# Altium schematic sheet Avalon2.SchDoc
size A1
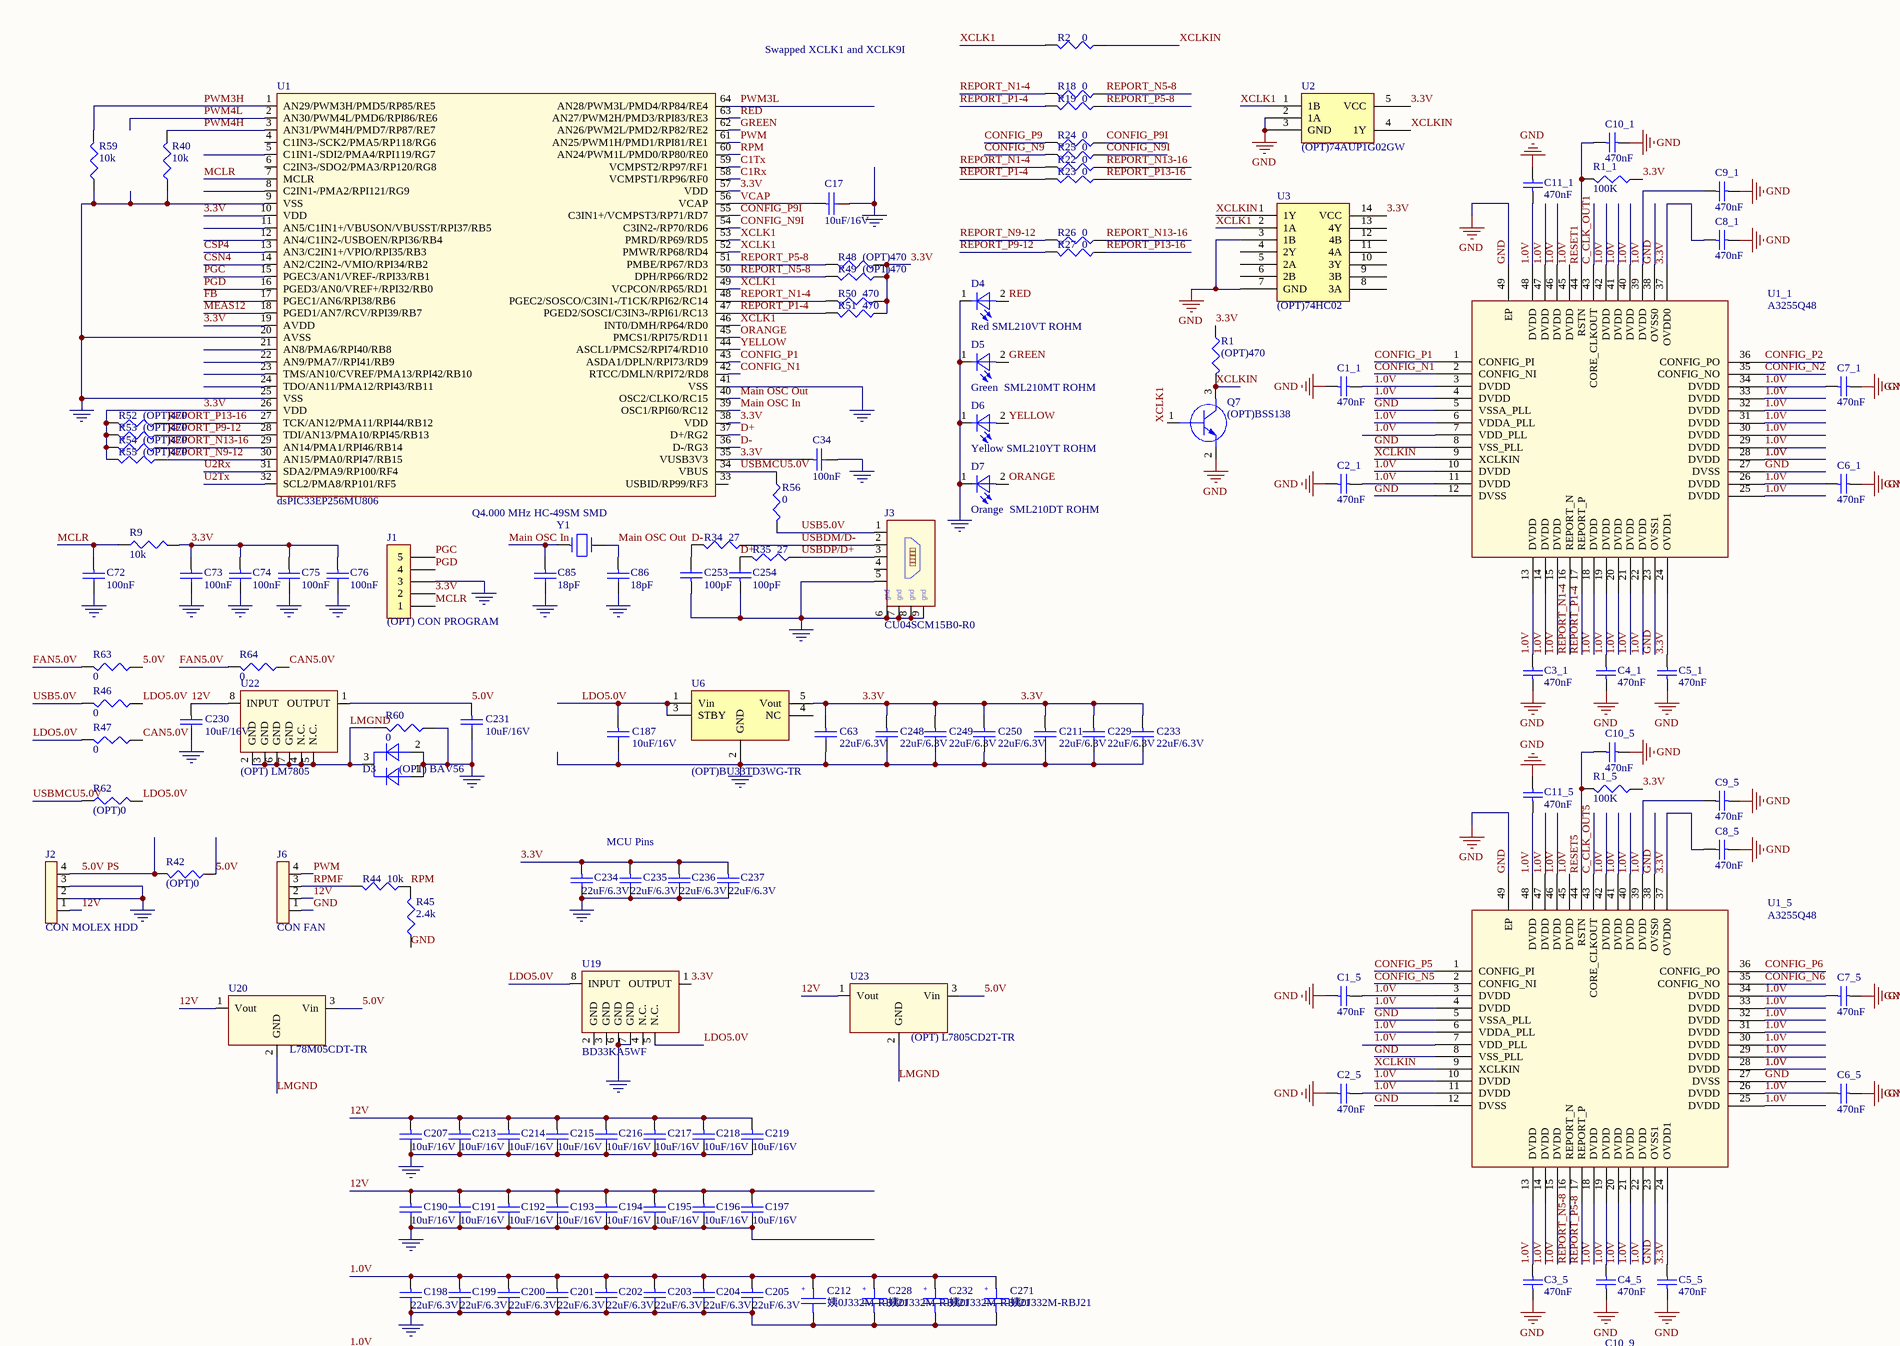
[diagram p0: Avalon2.SchDoc, top left]
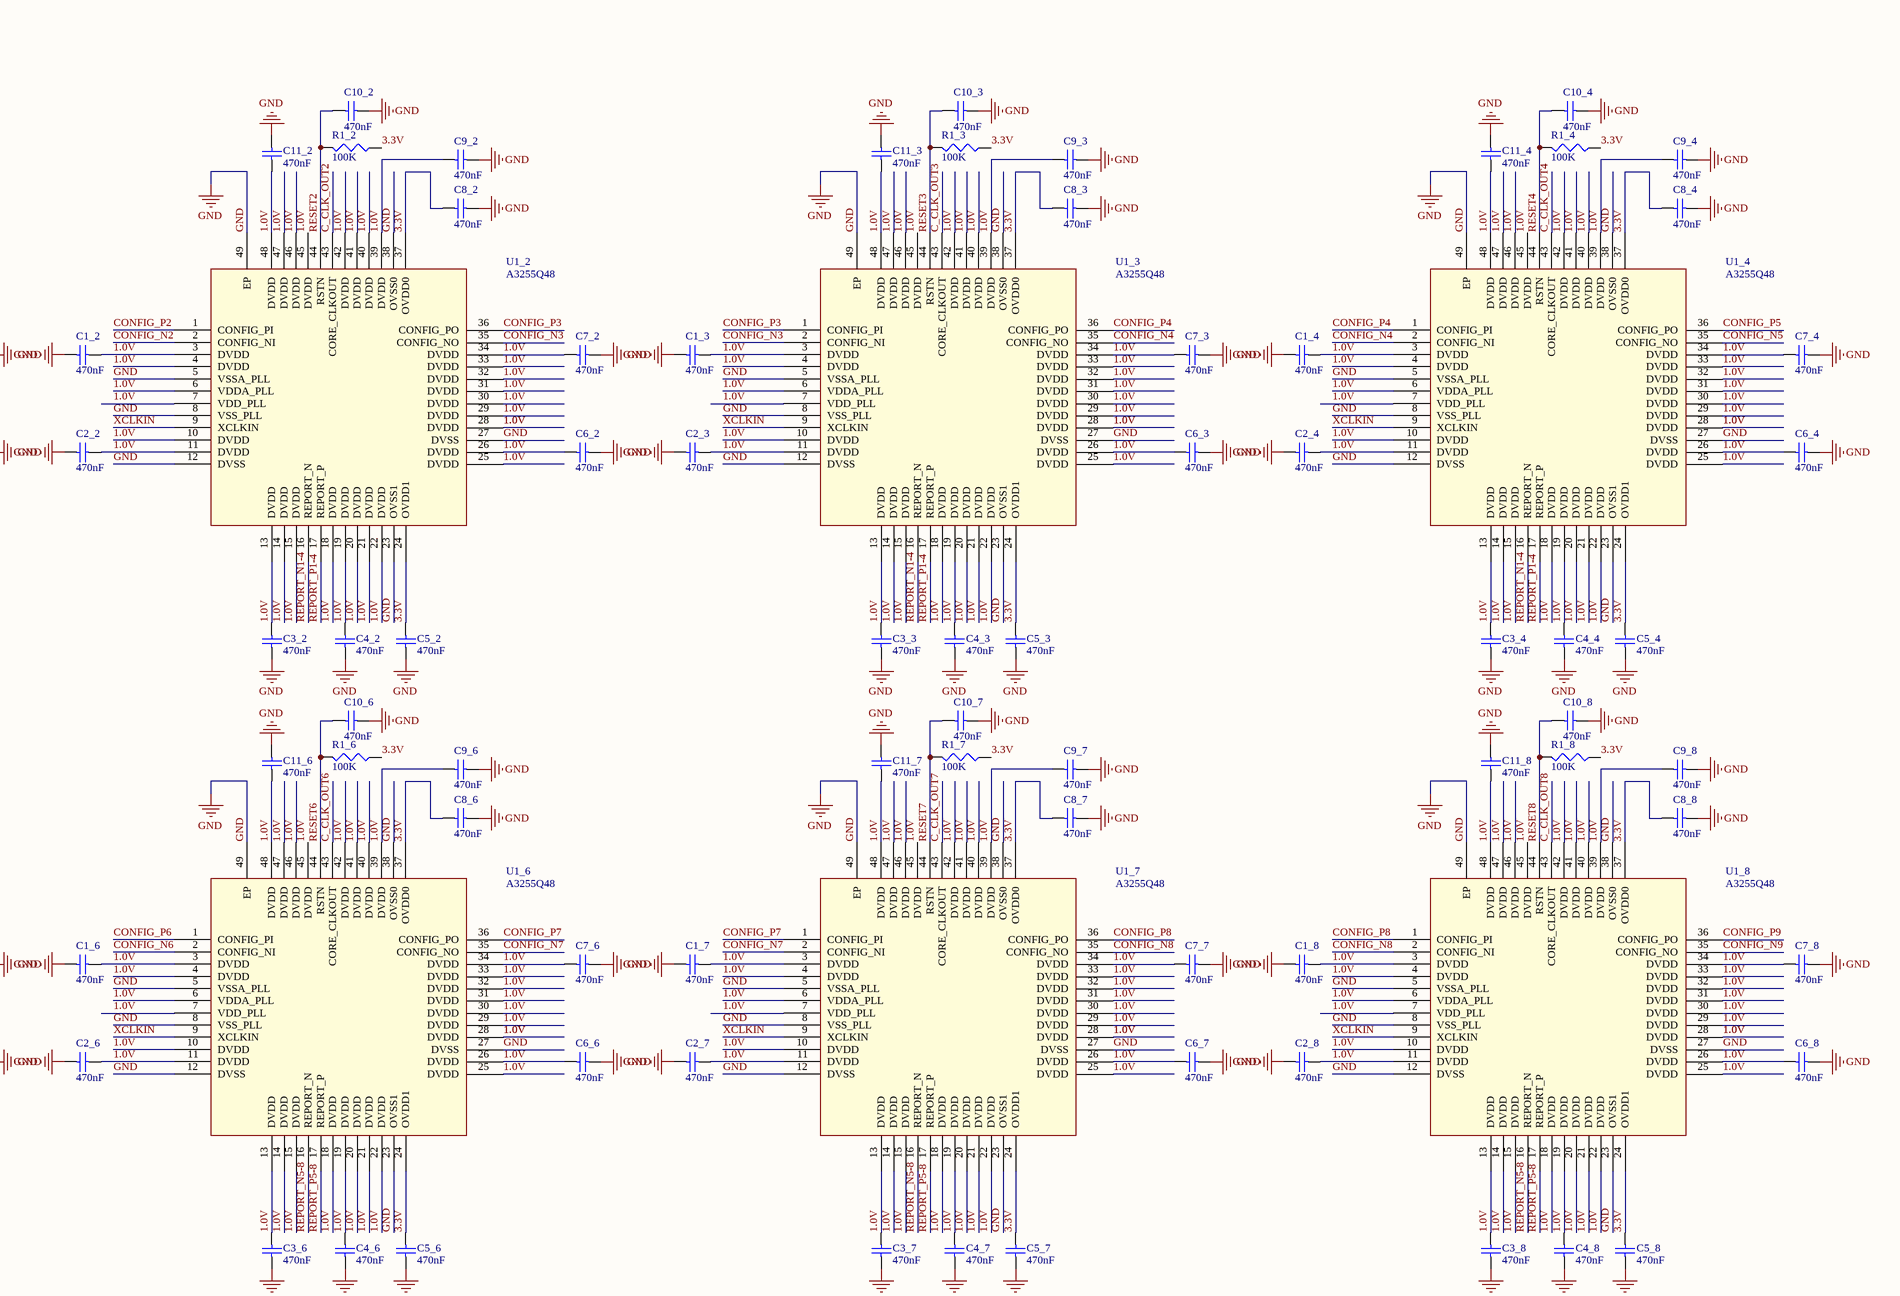
[diagram p1: Avalon2.SchDoc, top right]
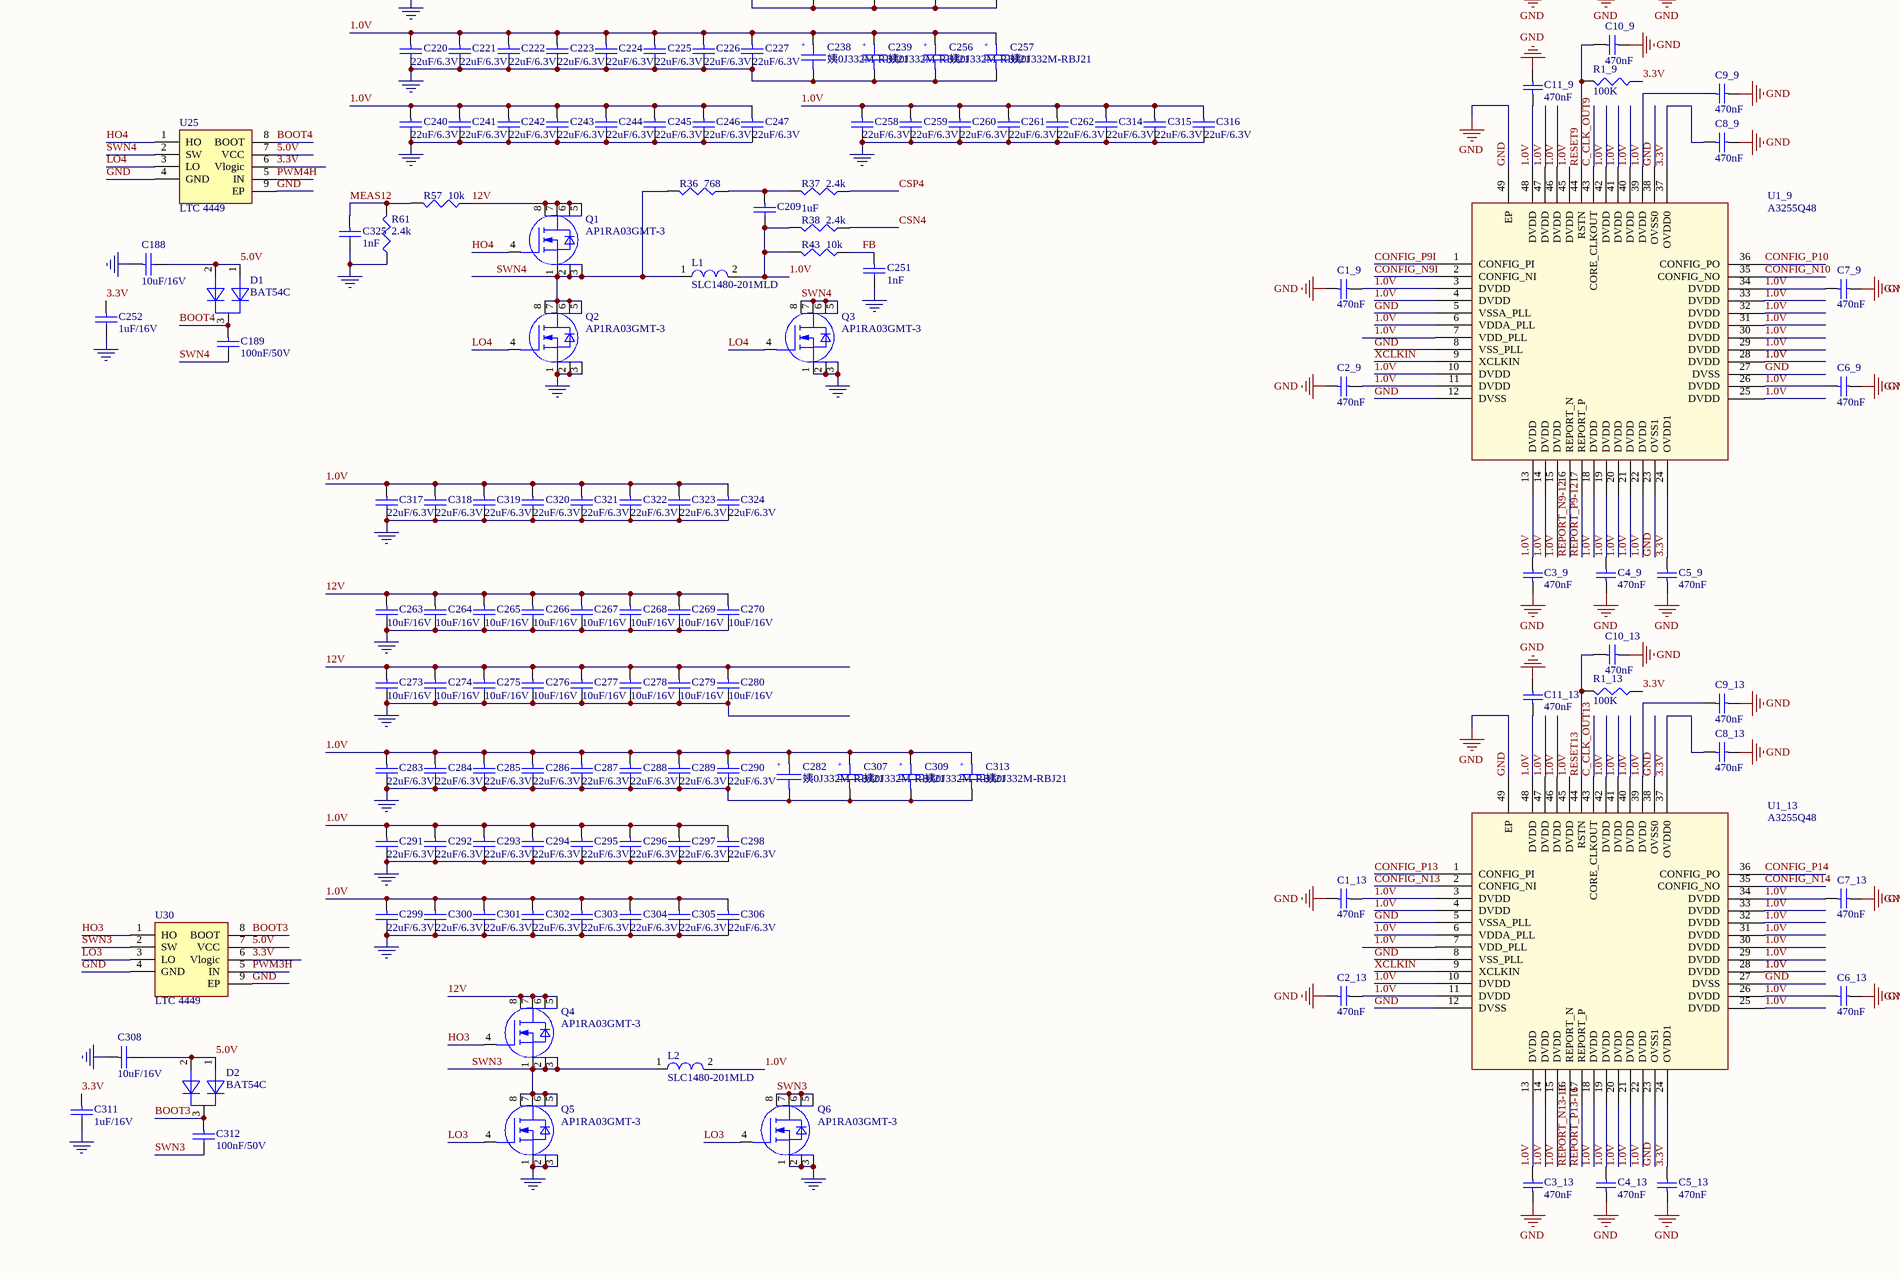
[diagram p2: Avalon2.SchDoc, bottom left]
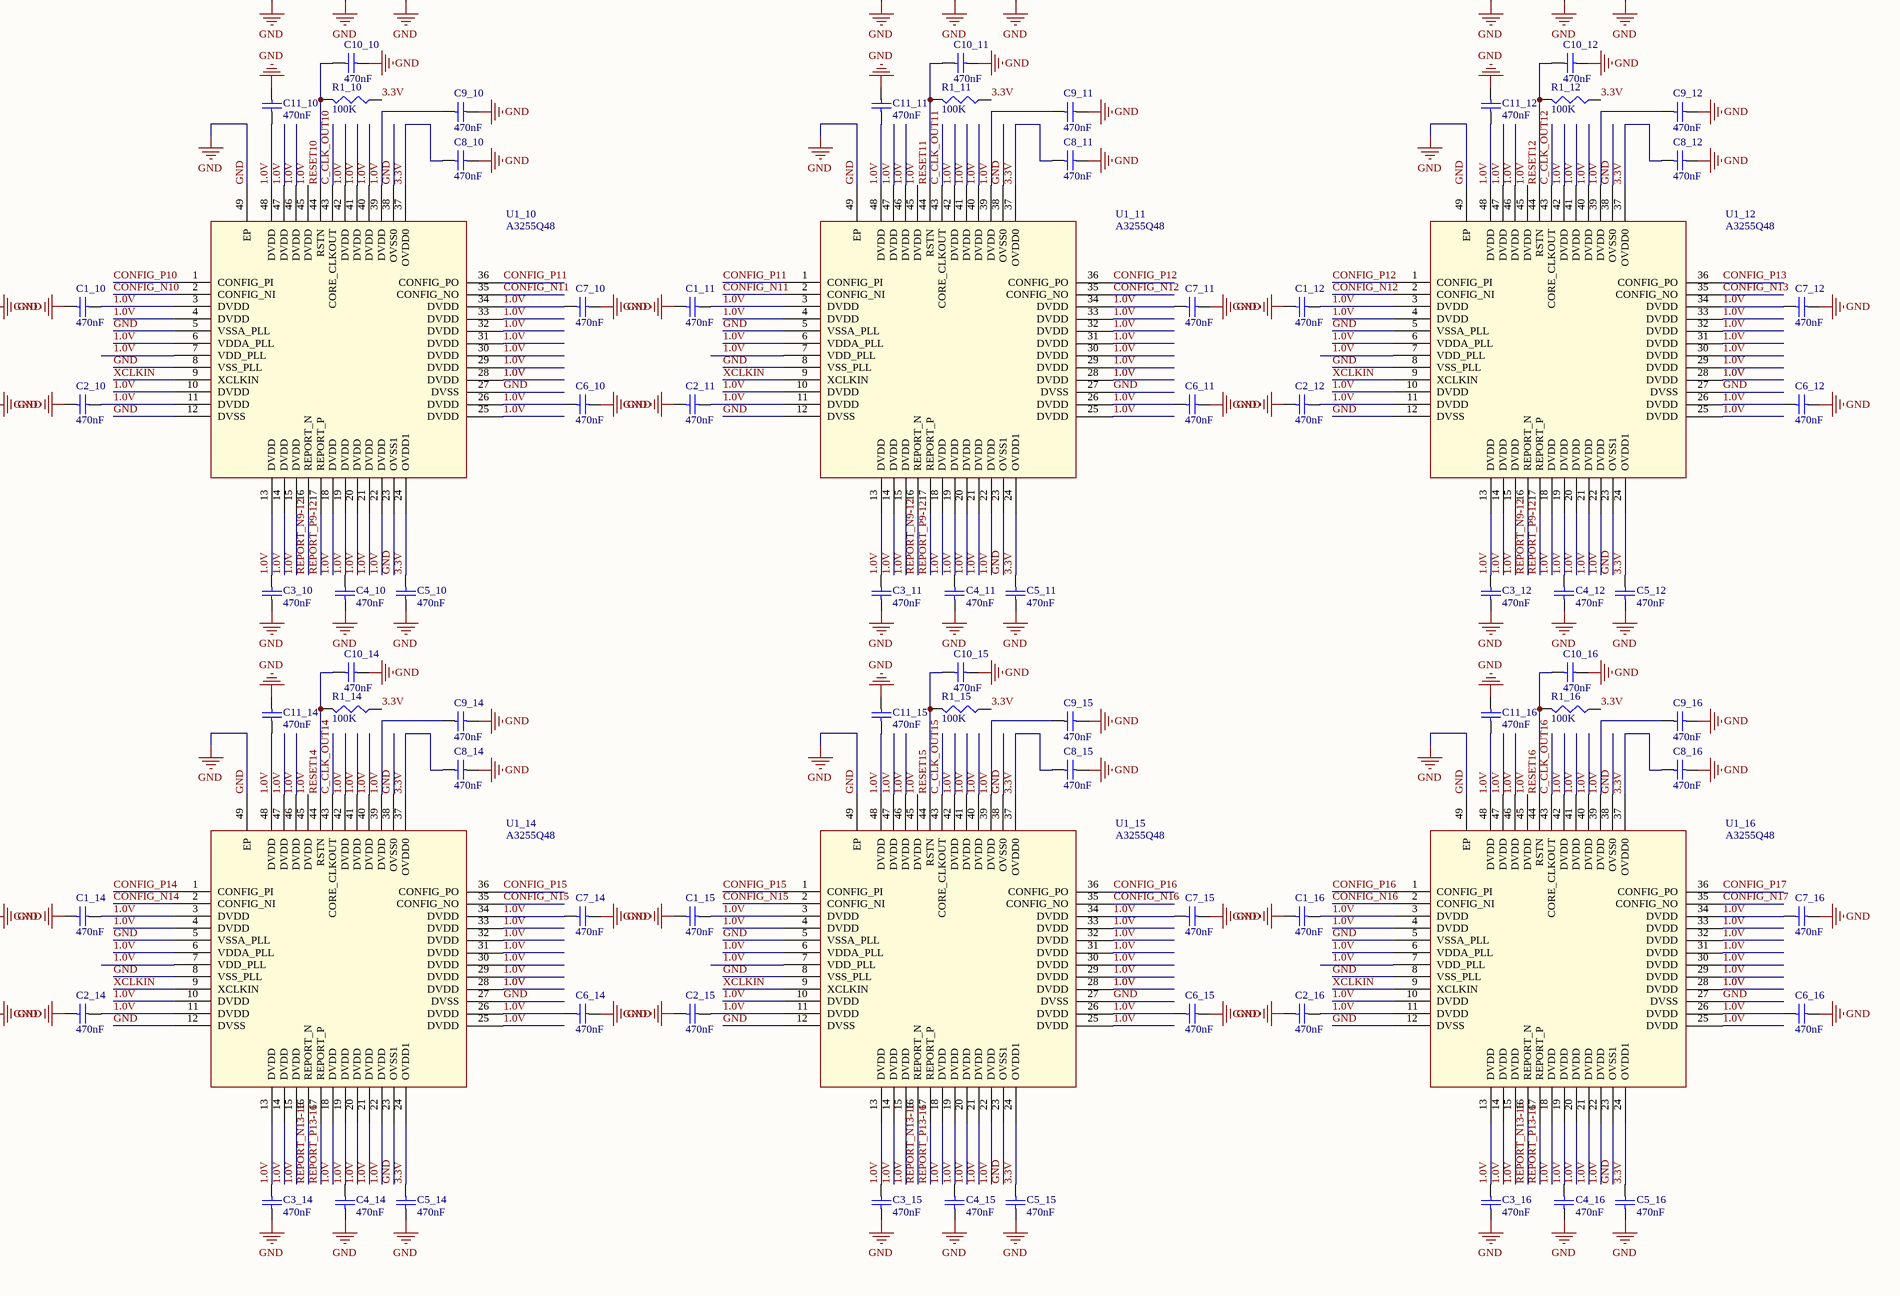
[diagram p3: Avalon2.SchDoc, bottom right]

## Parts
C1_1  470nF  [SMD_0603_CAPC1608X80N]
C1_2  470nF  [SMD_0603_CAPC1608X80N]
C1_3  470nF  [SMD_0603_CAPC1608X80N]
C1_4  470nF  [SMD_0603_CAPC1608X80N]
C1_5  470nF  [SMD_0603_CAPC1608X80N]
C1_6  470nF  [SMD_0603_CAPC1608X80N]
C1_7  470nF  [SMD_0603_CAPC1608X80N]
C1_8  470nF  [SMD_0603_CAPC1608X80N]
C1_9  470nF  [SMD_0603_CAPC1608X80N]
C1_10  470nF  [SMD_0603_CAPC1608X80N]
C1_11  470nF  [SMD_0603_CAPC1608X80N]
C1_12  470nF  [SMD_0603_CAPC1608X80N]
C1_13  470nF  [SMD_0603_CAPC1608X80N]
C1_14  470nF  [SMD_0603_CAPC1608X80N]
C1_15  470nF  [SMD_0603_CAPC1608X80N]
C1_16  470nF  [SMD_0603_CAPC1608X80N]
C2_1  470nF  [SMD_0603_CAPC1608X80N]
C2_2  470nF  [SMD_0603_CAPC1608X80N]
C2_3  470nF  [SMD_0603_CAPC1608X80N]
C2_4  470nF  [SMD_0603_CAPC1608X80N]
C2_5  470nF  [SMD_0603_CAPC1608X80N]
C2_6  470nF  [SMD_0603_CAPC1608X80N]
C2_7  470nF  [SMD_0603_CAPC1608X80N]
C2_8  470nF  [SMD_0603_CAPC1608X80N]
C2_9  470nF  [SMD_0603_CAPC1608X80N]
C2_10  470nF  [SMD_0603_CAPC1608X80N]
C2_11  470nF  [SMD_0603_CAPC1608X80N]
C2_12  470nF  [SMD_0603_CAPC1608X80N]
C2_13  470nF  [SMD_0603_CAPC1608X80N]
C2_14  470nF  [SMD_0603_CAPC1608X80N]
C2_15  470nF  [SMD_0603_CAPC1608X80N]
C2_16  470nF  [SMD_0603_CAPC1608X80N]
C3_1  470nF  [SMD_0603_CAPC1608X80N]
C3_2  470nF  [SMD_0603_CAPC1608X80N]
C3_3  470nF  [SMD_0603_CAPC1608X80N]
C3_4  470nF  [SMD_0603_CAPC1608X80N]
C3_5  470nF  [SMD_0603_CAPC1608X80N]
C3_6  470nF  [SMD_0603_CAPC1608X80N]
C3_7  470nF  [SMD_0603_CAPC1608X80N]
C3_8  470nF  [SMD_0603_CAPC1608X80N]
C3_9  470nF  [SMD_0603_CAPC1608X80N]
C3_10  470nF  [SMD_0603_CAPC1608X80N]
C3_11  470nF  [SMD_0603_CAPC1608X80N]
C3_12  470nF  [SMD_0603_CAPC1608X80N]
C3_13  470nF  [SMD_0603_CAPC1608X80N]
C3_14  470nF  [SMD_0603_CAPC1608X80N]
C3_15  470nF  [SMD_0603_CAPC1608X80N]
C3_16  470nF  [SMD_0603_CAPC1608X80N]
C4_1  470nF  [SMD_0603_CAPC1608X80N]
C4_2  470nF  [SMD_0603_CAPC1608X80N]
C4_3  470nF  [SMD_0603_CAPC1608X80N]
C4_4  470nF  [SMD_0603_CAPC1608X80N]
C4_5  470nF  [SMD_0603_CAPC1608X80N]
C4_6  470nF  [SMD_0603_CAPC1608X80N]
C4_7  470nF  [SMD_0603_CAPC1608X80N]
C4_8  470nF  [SMD_0603_CAPC1608X80N]
C4_9  470nF  [SMD_0603_CAPC1608X80N]
C4_10  470nF  [SMD_0603_CAPC1608X80N]
C4_11  470nF  [SMD_0603_CAPC1608X80N]
C4_12  470nF  [SMD_0603_CAPC1608X80N]
C4_13  470nF  [SMD_0603_CAPC1608X80N]
C4_14  470nF  [SMD_0603_CAPC1608X80N]
C4_15  470nF  [SMD_0603_CAPC1608X80N]
C4_16  470nF  [SMD_0603_CAPC1608X80N]
C5_1  470nF  [SMD_0603_CAPC1608X80N]
C5_2  470nF  [SMD_0603_CAPC1608X80N]
C5_3  470nF  [SMD_0603_CAPC1608X80N]
C5_4  470nF  [SMD_0603_CAPC1608X80N]
C5_5  470nF  [SMD_0603_CAPC1608X80N]
C5_6  470nF  [SMD_0603_CAPC1608X80N]
C5_7  470nF  [SMD_0603_CAPC1608X80N]
C5_8  470nF  [SMD_0603_CAPC1608X80N]
C5_9  470nF  [SMD_0603_CAPC1608X80N]
C5_10  470nF  [SMD_0603_CAPC1608X80N]
C5_11  470nF  [SMD_0603_CAPC1608X80N]
C5_12  470nF  [SMD_0603_CAPC1608X80N]
C5_13  470nF  [SMD_0603_CAPC1608X80N]
C5_14  470nF  [SMD_0603_CAPC1608X80N]
C5_15  470nF  [SMD_0603_CAPC1608X80N]
C5_16  470nF  [SMD_0603_CAPC1608X80N]
C6_1  470nF  [SMD_0603_CAPC1608X80N]
C6_2  470nF  [SMD_0603_CAPC1608X80N]
C6_3  470nF  [SMD_0603_CAPC1608X80N]
C6_4  470nF  [SMD_0603_CAPC1608X80N]
C6_5  470nF  [SMD_0603_CAPC1608X80N]
C6_6  470nF  [SMD_0603_CAPC1608X80N]
C6_7  470nF  [SMD_0603_CAPC1608X80N]
C6_8  470nF  [SMD_0603_CAPC1608X80N]
C6_9  470nF  [SMD_0603_CAPC1608X80N]
C6_10  470nF  [SMD_0603_CAPC1608X80N]
C6_11  470nF  [SMD_0603_CAPC1608X80N]
C6_12  470nF  [SMD_0603_CAPC1608X80N]
C6_13  470nF  [SMD_0603_CAPC1608X80N]
C6_14  470nF  [SMD_0603_CAPC1608X80N]
C6_15  470nF  [SMD_0603_CAPC1608X80N]
C6_16  470nF  [SMD_0603_CAPC1608X80N]
C7_1  470nF  [SMD_0603_CAPC1608X80N]
C7_2  470nF  [SMD_0603_CAPC1608X80N]
C7_3  470nF  [SMD_0603_CAPC1608X80N]
C7_4  470nF  [SMD_0603_CAPC1608X80N]
C7_5  470nF  [SMD_0603_CAPC1608X80N]
C7_6  470nF  [SMD_0603_CAPC1608X80N]
C7_7  470nF  [SMD_0603_CAPC1608X80N]
C7_8  470nF  [SMD_0603_CAPC1608X80N]
C7_9  470nF  [SMD_0603_CAPC1608X80N]
C7_10  470nF  [SMD_0603_CAPC1608X80N]
C7_11  470nF  [SMD_0603_CAPC1608X80N]
C7_12  470nF  [SMD_0603_CAPC1608X80N]
C7_13  470nF  [SMD_0603_CAPC1608X80N]
C7_14  470nF  [SMD_0603_CAPC1608X80N]
C7_15  470nF  [SMD_0603_CAPC1608X80N]
C7_16  470nF  [SMD_0603_CAPC1608X80N]
C8_1  470nF  [SMD_0603_CAPC1608X80N]
C8_2  470nF  [SMD_0603_CAPC1608X80N]
C8_3  470nF  [SMD_0603_CAPC1608X80N]
C8_4  470nF  [SMD_0603_CAPC1608X80N]
C8_5  470nF  [SMD_0603_CAPC1608X80N]
C8_6  470nF  [SMD_0603_CAPC1608X80N]
C8_7  470nF  [SMD_0603_CAPC1608X80N]
C8_8  470nF  [SMD_0603_CAPC1608X80N]
C8_9  470nF  [SMD_0603_CAPC1608X80N]
C8_10  470nF  [SMD_0603_CAPC1608X80N]
C8_11  470nF  [SMD_0603_CAPC1608X80N]
C8_12  470nF  [SMD_0603_CAPC1608X80N]
C8_13  470nF  [SMD_0603_CAPC1608X80N]
C8_14  470nF  [SMD_0603_CAPC1608X80N]
C8_15  470nF  [SMD_0603_CAPC1608X80N]
C8_16  470nF  [SMD_0603_CAPC1608X80N]
C9_1  470nF  [SMD_0603_CAPC1608X80N]
C9_2  470nF  [SMD_0603_CAPC1608X80N]
C9_3  470nF  [SMD_0603_CAPC1608X80N]
C9_4  470nF  [SMD_0603_CAPC1608X80N]
C9_5  470nF  [SMD_0603_CAPC1608X80N]
C9_6  470nF  [SMD_0603_CAPC1608X80N]
C9_7  470nF  [SMD_0603_CAPC1608X80N]
C9_8  470nF  [SMD_0603_CAPC1608X80N]
C9_9  470nF  [SMD_0603_CAPC1608X80N]
C9_10  470nF  [SMD_0603_CAPC1608X80N]
C9_11  470nF  [SMD_0603_CAPC1608X80N]
C9_12  470nF  [SMD_0603_CAPC1608X80N]
C9_13  470nF  [SMD_0603_CAPC1608X80N]
C9_14  470nF  [SMD_0603_CAPC1608X80N]
C9_15  470nF  [SMD_0603_CAPC1608X80N]
C9_16  470nF  [SMD_0603_CAPC1608X80N]
C10_1  470nF  [SMD_0603_CAPC1608X80N]
C10_2  470nF  [SMD_0603_CAPC1608X80N]
C10_3  470nF  [SMD_0603_CAPC1608X80N]
C10_4  470nF  [SMD_0603_CAPC1608X80N]
C10_5  470nF  [SMD_0603_CAPC1608X80N]
C10_6  470nF  [SMD_0603_CAPC1608X80N]
C10_7  470nF  [SMD_0603_CAPC1608X80N]
C10_8  470nF  [SMD_0603_CAPC1608X80N]
C10_9  470nF  [SMD_0603_CAPC1608X80N]
C10_10  470nF  [SMD_0603_CAPC1608X80N]
C10_11  470nF  [SMD_0603_CAPC1608X80N]
C10_12  470nF  [SMD_0603_CAPC1608X80N]
C10_13  470nF  [SMD_0603_CAPC1608X80N]
C10_14  470nF  [SMD_0603_CAPC1608X80N]
C10_15  470nF  [SMD_0603_CAPC1608X80N]
C10_16  470nF  [SMD_0603_CAPC1608X80N]
C11_1  470nF  [SMD_0603_CAPC1608X80N]
C11_2  470nF  [SMD_0603_CAPC1608X80N]
C11_3  470nF  [SMD_0603_CAPC1608X80N]
C11_4  470nF  [SMD_0603_CAPC1608X80N]
C11_5  470nF  [SMD_0603_CAPC1608X80N]
C11_6  470nF  [SMD_0603_CAPC1608X80N]
C11_7  470nF  [SMD_0603_CAPC1608X80N]
C11_8  470nF  [SMD_0603_CAPC1608X80N]
C11_9  470nF  [SMD_0603_CAPC1608X80N]
C11_10  470nF  [SMD_0603_CAPC1608X80N]
C11_11  470nF  [SMD_0603_CAPC1608X80N]
C11_12  470nF  [SMD_0603_CAPC1608X80N]
C11_13  470nF  [SMD_0603_CAPC1608X80N]
C11_14  470nF  [SMD_0603_CAPC1608X80N]
C11_15  470nF  [SMD_0603_CAPC1608X80N]
C11_16  470nF  [SMD_0603_CAPC1608X80N]
C17  10uF/16V  [SMD_0805_CAPC2012X145N]
C34  100nF  [SMD_0603_CAPC1608X80N]
C63  22uF/6.3V  [SMD_0805_CAPC2012X145N]
C72  100nF  [SMD_0603_CAPC1608X80N]
C73  100nF  [SMD_0603_CAPC1608X80N]
C74  100nF  [SMD_0603_CAPC1608X80N]
C75  100nF  [SMD_0603_CAPC1608X80N]
C76  100nF  [SMD_0603_CAPC1608X80N]
C85  18pF  [SMD_0603_CAPC1608X80N]
C86  18pF  [SMD_0603_CAPC1608X80N]
C187  10uF/16V  [SMD_0805_CAPC2012X145N]
C188  10uF/16V  [SMD_0805_CAPC2012X145N]
C189  100nF/50V  [SMD_0805_CAPC2012X145N]
C190  10uF/16V  [SMD_0805_CAPC2012X145N]
C191  10uF/16V  [SMD_0805_CAPC2012X145N]
C192  10uF/16V  [SMD_0805_CAPC2012X145N]
C193  10uF/16V  [SMD_0805_CAPC2012X145N]
C194  10uF/16V  [SMD_0805_CAPC2012X145N]
C195  10uF/16V  [SMD_0805_CAPC2012X145N]
C196  10uF/16V  [SMD_0805_CAPC2012X145N]
C197  10uF/16V  [SMD_0805_CAPC2012X145N]
C198  22uF/6.3V  [SMD_0805_CAPC2012X145N]
C199  22uF/6.3V  [SMD_0805_CAPC2012X145N]
C200  22uF/6.3V  [SMD_0805_CAPC2012X145N]
C201  22uF/6.3V  [SMD_0805_CAPC2012X145N]
C202  22uF/6.3V  [SMD_0805_CAPC2012X145N]
C203  22uF/6.3V  [SMD_0805_CAPC2012X145N]
C204  22uF/6.3V  [SMD_0805_CAPC2012X145N]
C205  22uF/6.3V  [SMD_0805_CAPC2012X145N]
C207  10uF/16V  [SMD_0805_CAPC2012X145N]
C209  1uF  [SMD_0805_CAPC2012X145N]
C211  22uF/6.3V  [SMD_0805_CAPC2012X145N]
C212  姨0J332M-RBJ21  [PTH_CAPPR500-1300X2250]
C213  10uF/16V  [SMD_0805_CAPC2012X145N]
C214  10uF/16V  [SMD_0805_CAPC2012X145N]
C215  10uF/16V  [SMD_0805_CAPC2012X145N]
C216  10uF/16V  [SMD_0805_CAPC2012X145N]
C217  10uF/16V  [SMD_0805_CAPC2012X145N]
C218  10uF/16V  [SMD_0805_CAPC2012X145N]
C219  10uF/16V  [SMD_0805_CAPC2012X145N]
C220  22uF/6.3V  [SMD_0805_CAPC2012X145N]
C221  22uF/6.3V  [SMD_0805_CAPC2012X145N]
C222  22uF/6.3V  [SMD_0805_CAPC2012X145N]
C223  22uF/6.3V  [SMD_0805_CAPC2012X145N]
C224  22uF/6.3V  [SMD_0805_CAPC2012X145N]
C225  22uF/6.3V  [SMD_0805_CAPC2012X145N]
C226  22uF/6.3V  [SMD_0805_CAPC2012X145N]
C227  22uF/6.3V  [SMD_0805_CAPC2012X145N]
C228  姨0J332M-RBJ21  [PTH_CAPPR500-1300X2250]
C229  22uF/6.3V  [SMD_0805_CAPC2012X145N]
C230  10uF/16V  [SMD_0805_CAPC2012X145N]
C231  10uF/16V  [SMD_0805_CAPC2012X145N]
C232  姨0J332M-RBJ21  [PTH_CAPPR500-1300X2250]
C233  22uF/6.3V  [SMD_0805_CAPC2012X145N]
C234  22uF/6.3V  [SMD_0805_CAPC2012X145N]
C235  22uF/6.3V  [SMD_0805_CAPC2012X145N]
C236  22uF/6.3V  [SMD_0805_CAPC2012X145N]
C237  22uF/6.3V  [SMD_0805_CAPC2012X145N]
C238  姨0J332M-RBJ21  [PTH_CAPPR500-1300X2250]
C239  姨0J332M-RBJ21  [PTH_CAPPR500-1300X2250]
C240  22uF/6.3V  [SMD_0805_CAPC2012X145N]
C241  22uF/6.3V  [SMD_0805_CAPC2012X145N]
C242  22uF/6.3V  [SMD_0805_CAPC2012X145N]
C243  22uF/6.3V  [SMD_0805_CAPC2012X145N]
C244  22uF/6.3V  [SMD_0805_CAPC2012X145N]
C245  22uF/6.3V  [SMD_0805_CAPC2012X145N]
C246  22uF/6.3V  [SMD_0805_CAPC2012X145N]
C247  22uF/6.3V  [SMD_0805_CAPC2012X145N]
C248  22uF/6.3V  [SMD_0805_CAPC2012X145N]
C249  22uF/6.3V  [SMD_0805_CAPC2012X145N]
C250  22uF/6.3V  [SMD_0805_CAPC2012X145N]
C251  1nF  [SMD_0603_CAPC1608X80N]
C252  1uF/16V  [SMD_0805_CAPC2012X145N]
C253  100pF  [SMD_0603_CAPC1608X80N]
C254  100pF  [SMD_0603_CAPC1608X80N]
C256  姨0J332M-RBJ21  [PTH_CAPPR500-1300X2250]
C257  姨0J332M-RBJ21  [PTH_CAPPR500-1300X2250]
C258  22uF/6.3V  [SMD_0805_CAPC2012X145N]
C259  22uF/6.3V  [SMD_0805_CAPC2012X145N]
C260  22uF/6.3V  [SMD_0805_CAPC2012X145N]
C261  22uF/6.3V  [SMD_0805_CAPC2012X145N]
C262  22uF/6.3V  [SMD_0805_CAPC2012X145N]
C263  10uF/16V  [SMD_0805_CAPC2012X145N]
C264  10uF/16V  [SMD_0805_CAPC2012X145N]
C265  10uF/16V  [SMD_0805_CAPC2012X145N]
C266  10uF/16V  [SMD_0805_CAPC2012X145N]
C267  10uF/16V  [SMD_0805_CAPC2012X145N]
C268  10uF/16V  [SMD_0805_CAPC2012X145N]
C269  10uF/16V  [SMD_0805_CAPC2012X145N]
C270  10uF/16V  [SMD_0805_CAPC2012X145N]
C271  姨0J332M-RBJ21  [PTH_CAPPR500-1300X2250]
C273  10uF/16V  [SMD_0805_CAPC2012X145N]
C274  10uF/16V  [SMD_0805_CAPC2012X145N]
C275  10uF/16V  [SMD_0805_CAPC2012X145N]
C276  10uF/16V  [SMD_0805_CAPC2012X145N]
C277  10uF/16V  [SMD_0805_CAPC2012X145N]
C278  10uF/16V  [SMD_0805_CAPC2012X145N]
C279  10uF/16V  [SMD_0805_CAPC2012X145N]
C280  10uF/16V  [SMD_0805_CAPC2012X145N]
C282  姨0J332M-RBJ21  [PTH_CAPPR500-1300X2250]
C283  22uF/6.3V  [SMD_0805_CAPC2012X145N]
C284  22uF/6.3V  [SMD_0805_CAPC2012X145N]
C285  22uF/6.3V  [SMD_0805_CAPC2012X145N]
C286  22uF/6.3V  [SMD_0805_CAPC2012X145N]
C287  22uF/6.3V  [SMD_0805_CAPC2012X145N]
C288  22uF/6.3V  [SMD_0805_CAPC2012X145N]
C289  22uF/6.3V  [SMD_0805_CAPC2012X145N]
C290  22uF/6.3V  [SMD_0805_CAPC2012X145N]
C291  22uF/6.3V  [SMD_0805_CAPC2012X145N]
C292  22uF/6.3V  [SMD_0805_CAPC2012X145N]
C293  22uF/6.3V  [SMD_0805_CAPC2012X145N]
C294  22uF/6.3V  [SMD_0805_CAPC2012X145N]
C295  22uF/6.3V  [SMD_0805_CAPC2012X145N]
C296  22uF/6.3V  [SMD_0805_CAPC2012X145N]
C297  22uF/6.3V  [SMD_0805_CAPC2012X145N]
C298  22uF/6.3V  [SMD_0805_CAPC2012X145N]
C299  22uF/6.3V  [SMD_0805_CAPC2012X145N]
C300  22uF/6.3V  [SMD_0805_CAPC2012X145N]
C301  22uF/6.3V  [SMD_0805_CAPC2012X145N]
C302  22uF/6.3V  [SMD_0805_CAPC2012X145N]
C303  22uF/6.3V  [SMD_0805_CAPC2012X145N]
C304  22uF/6.3V  [SMD_0805_CAPC2012X145N]
C305  22uF/6.3V  [SMD_0805_CAPC2012X145N]
C306  22uF/6.3V  [SMD_0805_CAPC2012X145N]
C307  姨0J332M-RBJ21  [PTH_CAPPR500-1300X2250]
C308  10uF/16V  [SMD_0805_CAPC2012X145N]
C309  姨0J332M-RBJ21  [PTH_CAPPR500-1300X2250]
C311  1uF/16V  [SMD_0805_CAPC2012X145N]
C312  100nF/50V  [SMD_0805_CAPC2012X145N]
C313  姨0J332M-RBJ21  [PTH_CAPPR500-1300X2250]
C314  22uF/6.3V  [SMD_0805_CAPC2012X145N]
C315  22uF/6.3V  [SMD_0805_CAPC2012X145N]
C316  22uF/6.3V  [SMD_0805_CAPC2012X145N]
C317  22uF/6.3V  [SMD_0805_CAPC2012X145N]
C318  22uF/6.3V  [SMD_0805_CAPC2012X145N]
C319  22uF/6.3V  [SMD_0805_CAPC2012X145N]
C320  22uF/6.3V  [SMD_0805_CAPC2012X145N]
C321  22uF/6.3V  [SMD_0805_CAPC2012X145N]
C322  22uF/6.3V  [SMD_0805_CAPC2012X145N]
C323  22uF/6.3V  [SMD_0805_CAPC2012X145N]
C324  22uF/6.3V  [SMD_0805_CAPC2012X145N]
C325  1nF  [SMD_0603_CAPC1608X80N]
D1  BAT54C  [SMD_SOT23_SOT95P240X120-3N]
D2  BAT54C  [SMD_SOT23_SOT95P240X120-3N]
D3  (OPT) BAV56  [SMD_SOT23_SOT95P240X120-3N]
D4  Red SML210VT ROHM  [SMD_0805_LED2012X100N]
D5  Green 	SML210MT ROHM  [SMD_0805_LED2012X100N]
D6  Yellow SML210YT ROHM  [SMD_0805_LED2012X100N]
D7  Orange 	SML210DT ROHM  [SMD_0805_LED2012X100N]
J1  (OPT) CON PROGRAM  [SIP5 PGM TOP]
J2  CON MOLEX HDD  [MOLEX_PWR_4P - AVALON]
J3  CU04SCM15B0-R0  [SMD_CON-CVILUX-CU04-SCM15B0]
J6  CON FAN  [PTH_CON_PANCON-MPSS100-04D]
L1  SLC1480-201MLD  [SMD_INDM12501250X800A - Coilcraft SLC1480]
L2  SLC1480-201MLD  [SMD_INDM12501250X800A - Coilcraft SLC1480]
Q1  AP1RA03GMT-3  [SMD_SON127P615X520X100-8N]
Q2  AP1RA03GMT-3  [SMD_SON127P615X520X100-8N]
Q3  AP1RA03GMT-3  [SMD_SON127P615X520X100-8N]
Q4  AP1RA03GMT-3  [SMD_SON127P615X520X100-8N]
Q5  AP1RA03GMT-3  [SMD_SON127P615X520X100-8N]
Q6  AP1RA03GMT-3  [SMD_SON127P615X520X100-8N]
Q7  (OPT)BSS138  [SMD_SOT23_SOT95P240X120-3N]
R1  (OPT)470  [SMD_0603_RESC1608X55N]
R1_1  100K  [SMD_0603_RESC1608X55N]
R1_2  100K  [SMD_0603_RESC1608X55N]
R1_3  100K  [SMD_0603_RESC1608X55N]
R1_4  100K  [SMD_0603_RESC1608X55N]
R1_5  100K  [SMD_0603_RESC1608X55N]
R1_6  100K  [SMD_0603_RESC1608X55N]
R1_7  100K  [SMD_0603_RESC1608X55N]
R1_8  100K  [SMD_0603_RESC1608X55N]
R1_9  100K  [SMD_0603_RESC1608X55N]
R1_10  100K  [SMD_0603_RESC1608X55N]
R1_11  100K  [SMD_0603_RESC1608X55N]
R1_12  100K  [SMD_0603_RESC1608X55N]
R1_13  100K  [SMD_0603_RESC1608X55N]
R1_14  100K  [SMD_0603_RESC1608X55N]
R1_15  100K  [SMD_0603_RESC1608X55N]
R1_16  100K  [SMD_0603_RESC1608X55N]
R2  0  [SMD_0603_RESC1608X55N]
R9  10k  [SMD_0603_RESC1608X55N]
R18  0  [SMD_0603_RESC1608X55N]
R19  0  [SMD_0603_RESC1608X55N]
R22  0  [SMD_0603_RESC1608X55N]
R23  0  [SMD_0603_RESC1608X55N]
R24  0  [SMD_0603_RESC1608X55N]
R25  0  [SMD_0603_RESC1608X55N]
R26  0  [SMD_0603_RESC1608X55N]
R27  0  [SMD_0603_RESC1608X55N]
R34  27  [SMD_0603_RESC1608X55N]
R35  27  [SMD_0603_RESC1608X55N]
R36  768  [SMD_0603_RESC1608X55N]
R37  2.4k  [SMD_0603_RESC1608X55N]
R38  2.4k  [SMD_0603_RESC1608X55N]
R40  10k  [SMD_0603_RESC1608X55N]
R42  (OPT)0  [SMD_0603_RESC1608X55N]
R43  10k  [SMD_0603_RESC1608X55N]
R44  10k  [SMD_0603_RESC1608X55N]
R45  2.4k  [SMD_0603_RESC1608X55N]
R46  0  [SMD_1206_RESC3216X180N]
R47  0  [SMD_1206_RESC3216X180N]
R48  (OPT)470  [SMD_0603_RESC1608X55N]
R49  (OPT)470  [SMD_0603_RESC1608X55N]
R50  470  [SMD_0603_RESC1608X55N]
R51  470  [SMD_0603_RESC1608X55N]
R52  (OPT)470  [SMD_0603_RESC1608X55N]
R53  (OPT)470  [SMD_0603_RESC1608X55N]
R54  (OPT)470  [SMD_0603_RESC1608X55N]
R55  (OPT)470  [SMD_0603_RESC1608X55N]
R56  0  [SMD_0603_RESC1608X55N]
R57  10k  [SMD_0603_RESC1608X55N]
R59  10k  [SMD_0603_RESC1608X55N]
R60  0  [SMD_1206_RESC3216X180N]
R61  2.4k  [SMD_0603_RESC1608X55N]
R62  (OPT)0  [SMD_0603_RESC1608X55N]
R63  0  [SMD_0603_RESC1608X55N]
R64  0  [SMD_0603_RESC1608X55N]
U1  dsPIC33EP256MU806  [SMD_QFP50P1200X1200X120-64N]
U1_1  A3255Q48  [SMD_QFN50P700X700X90-49N]
U1_2  A3255Q48  [SMD_QFN50P700X700X90-49N]
U1_3  A3255Q48  [SMD_QFN50P700X700X90-49N]
U1_4  A3255Q48  [SMD_QFN50P700X700X90-49N]
U1_5  A3255Q48  [SMD_QFN50P700X700X90-49N]
U1_6  A3255Q48  [SMD_QFN50P700X700X90-49N]
U1_7  A3255Q48  [SMD_QFN50P700X700X90-49N]
U1_8  A3255Q48  [SMD_QFN50P700X700X90-49N]
U1_9  A3255Q48  [SMD_QFN50P700X700X90-49N]
U1_10  A3255Q48  [SMD_QFN50P700X700X90-49N]
U1_11  A3255Q48  [SMD_QFN50P700X700X90-49N]
U1_12  A3255Q48  [SMD_QFN50P700X700X90-49N]
U1_13  A3255Q48  [SMD_QFN50P700X700X90-49N]
U1_14  A3255Q48  [SMD_QFN50P700X700X90-49N]
U1_15  A3255Q48  [SMD_QFN50P700X700X90-49N]
U1_16  A3255Q48  [SMD_QFN50P700X700X90-49N]
U2  (OPT)74AUP1G02GW  [SMD_SOT353_SOT65P210X110-5AN]
U3  (OPT)74HC02  [SMD_SOIC127P600X175-14N]
U6  (OPT)BU33TD3WG-TR  [SMD_SOT26_SOT95P285X140-5N - DLV]
U19  BD33KA5WF  [SMD_SOIC127P602X173-8N]
U20  L78M05CDT-TR  [SMD_TO229P991X239-4AN_DPAK]
U22  (OPT) LM7805  [SMD_SOIC127P602X173-8N]
U23  (OPT) L7805CD2T-TR  [SMD_TO254P1524X483-3_4N_D2PAK + DPAK]
U25  LTC 4449  [SMD_SOP65P490X110-9N - DUAL]
U30  LTC 4449  [SMD_SOP65P490X110-9N - DUAL]
Y1  Q4.000 MHz HC-49SM SMD  [SMD_HC49_XTAL1140X480X420N]

## Nets
GND: C1_1.2 C1_2.2 C1_3.2 C1_4.2 C1_5.2 C1_6.2 C1_7.2 C1_8.2 C1_9.2 C1_10.2 C1_11.2 C1_12.2 C1_13.2 C1_14.2 C1_15.2 C1_16.2 C2_1.2 C2_2.2 C2_3.2 C2_4.2 C2_5.2 C2_6.2 C2_7.2 C2_8.2 C2_9.2 C2_10.2 C2_11.2 C2_12.2 C2_13.2 C2_14.2 C2_15.2 C2_16.2 C3_1.2 C3_2.2 C3_3.2 C3_4.2 C3_5.2 C3_6.2 C3_7.2 C3_8.2 C3_9.2 C3_10.2 C3_11.2 C3_12.2 C3_13.2 C3_14.2 C3_15.2 C3_16.2 C4_1.2 C4_2.2 C4_3.2 C4_4.2 C4_5.2 C4_6.2 C4_7.2 C4_8.2 C4_9.2 C4_10.2 C4_11.2 C4_12.2 C4_13.2 C4_14.2 C4_15.2 C4_16.2 C5_1.1 C5_2.1 C5_3.1 C5_4.1 C5_5.1 C5_6.1 C5_7.1 C5_8.1 C5_9.1 C5_10.1 C5_11.1 C5_12.1 C5_13.1 C5_14.1 C5_15.1 C5_16.1 C6_1.2 C6_2.2 C6_3.2 C6_4.2 C6_5.2 C6_6.2 C6_7.2 C6_8.2 C6_9.2 C6_10.2 C6_11.2 C6_12.2 C6_13.2 C6_14.2 C6_15.2 C6_16.2 C7_1.2 C7_2.2 C7_3.2 C7_4.2 C7_5.2 C7_6.2 C7_7.2 C7_8.2 C7_9.2 C7_10.2 C7_11.2 C7_12.2 C7_13.2 C7_14.2 C7_15.2 C7_16.2 C8_1.2 C8_2.2 C8_3.2 C8_4.2 C8_5.2 C8_6.2 C8_7.2 C8_8.2 C8_9.2 C8_10.2 C8_11.2 C8_12.2 C8_13.2 C8_14.2 C8_15.2 C8_16.2 C9_1.2 C9_2.2 C9_3.2 C9_4.2 C9_5.2 C9_6.2 C9_7.2 C9_8.2 C9_9.2 C9_10.2 C9_11.2 C9_12.2 C9_13.2 C9_14.2 C9_15.2 C9_16.2 C10_1.2 C10_2.2 C10_3.2 C10_4.2 C10_5.2 C10_6.2 C10_7.2 C10_8.2 C10_9.2 C10_10.2 C10_11.2 C10_12.2 C10_13.2 C10_14.2 C10_15.2 C10_16.2 C11_1.2 C11_2.2 C11_3.2 C11_4.2 C11_5.2 C11_6.2 C11_7.2 C11_8.2 C11_9.2 C11_10.2 C11_11.2 C11_12.2 C11_13.2 C11_14.2 C11_15.2 C11_16.2 C17.2 C34.2 C63.2 C72.2 C73.2 C74.2 C75.2 C76.2 C85.2 C86.2 C187.2 C188.1 C190.2 C191.2 C192.2 C193.2 C194.2 C195.2 C196.2 C197.2 C198.2 C199.2 C200.2 C201.2 C202.2 C203.2 C204.2 C205.2 C207.2 C211.2 C212.2 C213.2 C214.2 C215.2 C216.2 C217.2 C218.2 C219.2 C220.2 C221.2 C222.2 C223.2 C224.2 C225.2 C226.2 C227.2 C228.2 C229.2 C230.2 C231.2 C232.2 C233.2 C234.2 C235.2 C236.2 C237.2 C238.2 C239.2 C240.2 C241.2 C242.2 C243.2 C244.2 C245.2 C246.2 C247.2 C248.2 C249.2 C250.2 C251.2 C252.2 C253.1 C254.1 C256.2 C257.2 C258.2 C259.2 C260.2 C261.2 C262.2 C263.2 C264.2 C265.2 C266.2 C267.2 C268.2 C269.2 C270.2 C271.2 C273.2 C274.2 C275.2 C276.2 C277.2 C278.2 C279.2 C280.2 C282.2 C283.2 C284.2 C285.2 C286.2 C287.2 C288.2 C289.2 C290.2 C291.2 C292.2 C293.2 C294.2 C295.2 C296.2 C297.2 C298.2 C299.2 C300.2 C301.2 C302.2 C303.2 C304.2 C305.2 C306.2 C307.2 C308.1 C309.2 C311.2 C313.2 C314.2 C315.2 C316.2 C317.2 C318.2 C319.2 C320.2 C321.2 C322.2 C323.2 C324.2 C325.2 D3.1(A1) D3.2(A2) D4.1(C) D5.1(C) D6.1(C) D7.1(C) J1.3 J2.2 J2.3 J3.5 J3.6 J3.7 J3.8 J3.9 J6.1 Q2.1(S) Q2.2(S) Q2.3(S) Q3.1(S) Q3.2(S) Q3.3(S) Q5.1(S) Q5.2(S) Q5.3(S) Q6.1(S) Q6.2(S) Q6.3(S) Q7.2(E) R40.1 R45.1 R59.1 R60.1 R61.1 U1.9(VSS) U1.20(AVSS) U1.25(VSS) U1.41(VSS) U1_1.5(VSSA_PLL) U1_1.8(VSS_PLL) U1_1.12(DVSS) U1_1.23(OVSS1) U1_1.27(DVSS) U1_1.38(OVSS0) U1_1.49(EP) U1_2.5(VSSA_PLL) U1_2.8(VSS_PLL) U1_2.12(DVSS) U1_2.23(OVSS1) U1_2.27(DVSS) U1_2.38(OVSS0) U1_2.49(EP) U1_3.5(VSSA_PLL) U1_3.8(VSS_PLL) U1_3.12(DVSS) U1_3.23(OVSS1) U1_3.27(DVSS) U1_3.38(OVSS0) U1_3.49(EP) U1_4.5(VSSA_PLL) U1_4.8(VSS_PLL) U1_4.12(DVSS) U1_4.23(OVSS1) U1_4.27(DVSS) U1_4.38(OVSS0) U1_4.49(EP) U1_5.5(VSSA_PLL) U1_5.8(VSS_PLL) U1_5.12(DVSS) U1_5.23(OVSS1) U1_5.27(DVSS) U1_5.38(OVSS0) U1_5.49(EP) U1_6.5(VSSA_PLL) U1_6.8(VSS_PLL) U1_6.12(DVSS) U1_6.23(OVSS1) U1_6.27(DVSS) U1_6.38(OVSS0) U1_6.49(EP) U1_7.5(VSSA_PLL) U1_7.8(VSS_PLL) U1_7.12(DVSS) U1_7.23(OVSS1) U1_7.27(DVSS) U1_7.38(OVSS0) U1_7.49(EP) U1_8.5(VSSA_PLL) U1_8.8(VSS_PLL) U1_8.12(DVSS) U1_8.23(OVSS1) U1_8.27(DVSS) U1_8.38(OVSS0) U1_8.49(EP) U1_9.5(VSSA_PLL) U1_9.8(VSS_PLL) U1_9.12(DVSS) U1_9.23(OVSS1) U1_9.27(DVSS) U1_9.38(OVSS0) U1_9.49(EP) U1_10.5(VSSA_PLL) U1_10.8(VSS_PLL) U1_10.12(DVSS) U1_10.23(OVSS1) U1_10.27(DVSS) U1_10.38(OVSS0) U1_10.49(EP) U1_11.5(VSSA_PLL) U1_11.8(VSS_PLL) U1_11.12(DVSS) U1_11.23(OVSS1) U1_11.27(DVSS) U1_11.38(OVSS0) U1_11.49(EP) U1_12.5(VSSA_PLL) U1_12.8(VSS_PLL) U1_12.12(DVSS) U1_12.23(OVSS1) U1_12.27(DVSS) U1_12.38(OVSS0) U1_12.49(EP) U1_13.5(VSSA_PLL) U1_13.8(VSS_PLL) U1_13.12(DVSS) U1_13.23(OVSS1) U1_13.27(DVSS) U1_13.38(OVSS0) U1_13.49(EP) U1_14.5(VSSA_PLL) U1_14.8(VSS_PLL) U1_14.12(DVSS) U1_14.23(OVSS1) U1_14.27(DVSS) U1_14.38(OVSS0) U1_14.49(EP) U1_15.5(VSSA_PLL) U1_15.8(VSS_PLL) U1_15.12(DVSS) U1_15.23(OVSS1) U1_15.27(DVSS) U1_15.38(OVSS0) U1_15.49(EP) U1_16.5(VSSA_PLL) U1_16.8(VSS_PLL) U1_16.12(DVSS) U1_16.23(OVSS1) U1_16.27(DVSS) U1_16.38(OVSS0) U1_16.49(EP) U2.2(1A) U2.3(GND) U3.3(1B) U3.7(GND) U6.2(GND) U19.6(GND) U19.7(GND) U25.4(GND) U25.9(EP) U30.4(GND) U30.9(EP)
1.0V: C1_1.1 C1_2.1 C1_3.1 C1_4.1 C1_5.1 C1_6.1 C1_7.1 C1_8.1 C1_9.1 C1_10.1 C1_11.1 C1_12.1 C1_13.1 C1_14.1 C1_15.1 C1_16.1 C2_1.1 C2_2.1 C2_3.1 C2_4.1 C2_5.1 C2_6.1 C2_7.1 C2_8.1 C2_9.1 C2_10.1 C2_11.1 C2_12.1 C2_13.1 C2_14.1 C2_15.1 C2_16.1 C3_1.1 C3_2.1 C3_3.1 C3_4.1 C3_5.1 C3_6.1 C3_7.1 C3_8.1 C3_9.1 C3_10.1 C3_11.1 C3_12.1 C3_13.1 C3_14.1 C3_15.1 C3_16.1 C4_1.1 C4_2.1 C4_3.1 C4_4.1 C4_5.1 C4_6.1 C4_7.1 C4_8.1 C4_9.1 C4_10.1 C4_11.1 C4_12.1 C4_13.1 C4_14.1 C4_15.1 C4_16.1 C6_1.1 C6_2.1 C6_3.1 C6_4.1 C6_5.1 C6_6.1 C6_7.1 C6_8.1 C6_9.1 C6_10.1 C6_11.1 C6_12.1 C6_13.1 C6_14.1 C6_15.1 C6_16.1 C7_1.1 C7_2.1 C7_3.1 C7_4.1 C7_5.1 C7_6.1 C7_7.1 C7_8.1 C7_9.1 C7_10.1 C7_11.1 C7_12.1 C7_13.1 C7_14.1 C7_15.1 C7_16.1 C9_1.1 C9_2.1 C9_3.1 C9_4.1 C9_5.1 C9_6.1 C9_7.1 C9_8.1 C9_9.1 C9_10.1 C9_11.1 C9_12.1 C9_13.1 C9_14.1 C9_15.1 C9_16.1 C11_1.1 C11_2.1 C11_3.1 C11_4.1 C11_5.1 C11_6.1 C11_7.1 C11_8.1 C11_9.1 C11_10.1 C11_11.1 C11_12.1 C11_13.1 C11_14.1 C11_15.1 C11_16.1 C198.1 C199.1 C200.1 C201.1 C202.1 C203.1 C204.1 C205.1 C209.2 C212.1 C220.1 C221.1 C222.1 C223.1 C224.1 C225.1 C226.1 C227.1 C228.1 C232.1 C238.1 C239.1 C240.1 C241.1 C242.1 C243.1 C244.1 C245.1 C246.1 C247.1 C256.1 C257.1 C258.1 C259.1 C260.1 C261.1 C262.1 C271.1 C282.1 C283.1 C284.1 C285.1 C286.1 C287.1 C288.1 C289.1 C290.1 C291.1 C292.1 C293.1 C294.1 C295.1 C296.1 C297.1 C298.1 C299.1 C300.1 C301.1 C302.1 C303.1 C304.1 C305.1 C306.1 C307.1 C309.1 C313.1 C314.1 C315.1 C316.1 C317.1 C318.1 C319.1 C320.1 C321.1 C322.1 C323.1 C324.1 L1.2 L2.2 R38.2 R43.2 U1_1.3(DVDD) U1_1.4(DVDD) U1_1.6(VDDA_PLL) U1_1.7(VDD_PLL) U1_1.10(DVDD) U1_1.11(DVDD) U1_1.13(DVDD) U1_1.14(DVDD) U1_1.15(DVDD) U1_1.18(DVDD) U1_1.19(DVDD) U1_1.20(DVDD) U1_1.21(DVDD) U1_1.22(DVDD) U1_1.25(DVDD) U1_1.26(DVDD) U1_1.28(DVDD) U1_1.29(DVDD) U1_1.30(DVDD) U1_1.31(DVDD) U1_1.32(DVDD) U1_1.33(DVDD) U1_1.34(DVDD) U1_1.39(DVDD) U1_1.40(DVDD) U1_1.41(DVDD) U1_1.42(DVDD) U1_1.45(DVDD) U1_1.46(DVDD) U1_1.47(DVDD) U1_1.48(DVDD) U1_2.3(DVDD) U1_2.4(DVDD) U1_2.6(VDDA_PLL) U1_2.7(VDD_PLL) U1_2.10(DVDD) U1_2.11(DVDD) U1_2.13(DVDD) U1_2.14(DVDD) U1_2.15(DVDD) U1_2.18(DVDD) U1_2.19(DVDD) U1_2.20(DVDD) U1_2.21(DVDD) U1_2.22(DVDD) U1_2.25(DVDD) U1_2.26(DVDD) U1_2.28(DVDD) U1_2.29(DVDD) U1_2.30(DVDD) U1_2.31(DVDD) U1_2.32(DVDD) U1_2.33(DVDD) U1_2.34(DVDD) U1_2.39(DVDD) U1_2.40(DVDD) U1_2.41(DVDD) U1_2.42(DVDD) U1_2.45(DVDD) U1_2.46(DVDD) U1_2.47(DVDD) U1_2.48(DVDD) U1_3.3(DVDD) U1_3.4(DVDD) U1_3.6(VDDA_PLL) U1_3.7(VDD_PLL) U1_3.10(DVDD) U1_3.11(DVDD) U1_3.13(DVDD) U1_3.14(DVDD) U1_3.15(DVDD) U1_3.18(DVDD) U1_3.19(DVDD) U1_3.20(DVDD) U1_3.21(DVDD) U1_3.22(DVDD) U1_3.25(DVDD) U1_3.26(DVDD) U1_3.28(DVDD) U1_3.29(DVDD) U1_3.30(DVDD) U1_3.31(DVDD) U1_3.32(DVDD) U1_3.33(DVDD) U1_3.34(DVDD) U1_3.39(DVDD) U1_3.40(DVDD) U1_3.41(DVDD) U1_3.42(DVDD) U1_3.45(DVDD) U1_3.46(DVDD) U1_3.47(DVDD) U1_3.48(DVDD) U1_4.3(DVDD) U1_4.4(DVDD) U1_4.6(VDDA_PLL) U1_4.7(VDD_PLL) U1_4.10(DVDD) U1_4.11(DVDD) U1_4.13(DVDD) U1_4.14(DVDD) U1_4.15(DVDD) U1_4.18(DVDD) U1_4.19(DVDD) U1_4.20(DVDD) U1_4.21(DVDD) U1_4.22(DVDD) U1_4.25(DVDD) U1_4.26(DVDD) U1_4.28(DVDD) U1_4.29(DVDD) U1_4.30(DVDD) U1_4.31(DVDD) U1_4.32(DVDD) U1_4.33(DVDD) U1_4.34(DVDD) U1_4.39(DVDD) U1_4.40(DVDD) U1_4.41(DVDD) U1_4.42(DVDD) U1_4.45(DVDD) U1_4.46(DVDD) U1_4.47(DVDD) U1_4.48(DVDD) U1_5.3(DVDD) U1_5.4(DVDD) U1_5.6(VDDA_PLL) U1_5.7(VDD_PLL) U1_5.10(DVDD) U1_5.11(DVDD) U1_5.13(DVDD) U1_5.14(DVDD) U1_5.15(DVDD) U1_5.18(DVDD) U1_5.19(DVDD) U1_5.20(DVDD) U1_5.21(DVDD) U1_5.22(DVDD) U1_5.25(DVDD) U1_5.26(DVDD) U1_5.28(DVDD) U1_5.29(DVDD) U1_5.30(DVDD) U1_5.31(DVDD) U1_5.32(DVDD) U1_5.33(DVDD) U1_5.34(DVDD) U1_5.39(DVDD) U1_5.40(DVDD) U1_5.41(DVDD) U1_5.42(DVDD) U1_5.45(DVDD) U1_5.46(DVDD) U1_5.47(DVDD) U1_5.48(DVDD) U1_6.3(DVDD) U1_6.4(DVDD) U1_6.6(VDDA_PLL) U1_6.7(VDD_PLL) U1_6.10(DVDD) U1_6.11(DVDD) U1_6.13(DVDD) U1_6.14(DVDD) U1_6.15(DVDD) U1_6.18(DVDD) U1_6.19(DVDD) U1_6.20(DVDD) U1_6.21(DVDD) U1_6.22(DVDD) U1_6.25(DVDD) U1_6.26(DVDD) U1_6.28(DVDD) U1_6.29(DVDD) U1_6.30(DVDD) U1_6.31(DVDD) U1_6.32(DVDD) U1_6.33(DVDD) U1_6.34(DVDD) U1_6.39(DVDD) U1_6.40(DVDD) U1_6.41(DVDD) U1_6.42(DVDD) U1_6.45(DVDD) U1_6.46(DVDD) U1_6.47(DVDD) U1_6.48(DVDD) U1_7.3(DVDD) U1_7.4(DVDD) U1_7.6(VDDA_PLL) U1_7.7(VDD_PLL) U1_7.10(DVDD) U1_7.11(DVDD) U1_7.13(DVDD) U1_7.14(DVDD) U1_7.15(DVDD) U1_7.18(DVDD) U1_7.19(DVDD) U1_7.20(DVDD) U1_7.21(DVDD) U1_7.22(DVDD) U1_7.25(DVDD) U1_7.26(DVDD) U1_7.28(DVDD) U1_7.29(DVDD) U1_7.30(DVDD) U1_7.31(DVDD) U1_7.32(DVDD) U1_7.33(DVDD) U1_7.34(DVDD) U1_7.39(DVDD) U1_7.40(DVDD) U1_7.41(DVDD) U1_7.42(DVDD) U1_7.45(DVDD) U1_7.46(DVDD) U1_7.47(DVDD) U1_7.48(DVDD) U1_8.3(DVDD) U1_8.4(DVDD) U1_8.6(VDDA_PLL) U1_8.7(VDD_PLL) U1_8.10(DVDD) U1_8.11(DVDD) U1_8.13(DVDD) U1_8.14(DVDD) U1_8.15(DVDD) U1_8.18(DVDD) U1_8.19(DVDD) U1_8.20(DVDD) U1_8.21(DVDD) U1_8.22(DVDD) U1_8.25(DVDD) U1_8.26(DVDD) U1_8.28(DVDD) U1_8.29(DVDD) U1_8.30(DVDD) U1_8.31(DVDD) U1_8.32(DVDD) U1_8.33(DVDD) U1_8.34(DVDD) U1_8.39(DVDD) U1_8.40(DVDD) U1_8.41(DVDD) U1_8.42(DVDD) U1_8.45(DVDD) U1_8.46(DVDD) U1_8.47(DVDD) U1_8.48(DVDD) U1_9.3(DVDD) U1_9.4(DVDD) U1_9.6(VDDA_PLL) U1_9.7(VDD_PLL) U1_9.10(DVDD) U1_9.11(DVDD) U1_9.13(DVDD) U1_9.14(DVDD) U1_9.15(DVDD) U1_9.18(DVDD) U1_9.19(DVDD) U1_9.20(DVDD) U1_9.21(DVDD) U1_9.22(DVDD) U1_9.25(DVDD) U1_9.26(DVDD) U1_9.28(DVDD) U1_9.29(DVDD) U1_9.30(DVDD) U1_9.31(DVDD) U1_9.32(DVDD) U1_9.33(DVDD) U1_9.34(DVDD) U1_9.39(DVDD) U1_9.40(DVDD) U1_9.41(DVDD) U1_9.42(DVDD) U1_9.45(DVDD) U1_9.46(DVDD) U1_9.47(DVDD) U1_9.48(DVDD) U1_10.3(DVDD) U1_10.4(DVDD) U1_10.6(VDDA_PLL) U1_10.7(VDD_PLL) U1_10.10(DVDD) U1_10.11(DVDD) U1_10.13(DVDD) U1_10.14(DVDD) U1_10.15(DVDD) U1_10.18(DVDD) U1_10.19(DVDD) U1_10.20(DVDD) U1_10.21(DVDD) U1_10.22(DVDD) U1_10.25(DVDD) U1_10.26(DVDD) U1_10.28(DVDD) U1_10.29(DVDD) U1_10.30(DVDD) U1_10.31(DVDD) U1_10.32(DVDD) U1_10.33(DVDD) U1_10.34(DVDD) U1_10.39(DVDD) U1_10.40(DVDD) U1_10.41(DVDD) U1_10.42(DVDD) U1_10.45(DVDD) U1_10.46(DVDD) U1_10.47(DVDD) U1_10.48(DVDD) U1_11.3(DVDD) U1_11.4(DVDD) U1_11.6(VDDA_PLL) U1_11.7(VDD_PLL) U1_11.10(DVDD) U1_11.11(DVDD) U1_11.13(DVDD) U1_11.14(DVDD) U1_11.15(DVDD) U1_11.18(DVDD) U1_11.19(DVDD) U1_11.20(DVDD) U1_11.21(DVDD) U1_11.22(DVDD) U1_11.25(DVDD) U1_11.26(DVDD) U1_11.28(DVDD) U1_11.29(DVDD) U1_11.30(DVDD) U1_11.31(DVDD) U1_11.32(DVDD) U1_11.33(DVDD) U1_11.34(DVDD) U1_11.39(DVDD) U1_11.40(DVDD) U1_11.41(DVDD) U1_11.42(DVDD) U1_11.45(DVDD) U1_11.46(DVDD) U1_11.47(DVDD) U1_11.48(DVDD) U1_12.3(DVDD) U1_12.4(DVDD) U1_12.6(VDDA_PLL) U1_12.7(VDD_PLL) U1_12.10(DVDD) U1_12.11(DVDD) U1_12.13(DVDD) U1_12.14(DVDD) U1_12.15(DVDD) U1_12.18(DVDD) U1_12.19(DVDD) U1_12.20(DVDD) U1_12.21(DVDD) U1_12.22(DVDD) U1_12.25(DVDD) U1_12.26(DVDD) U1_12.28(DVDD) U1_12.29(DVDD) U1_12.30(DVDD) U1_12.31(DVDD) U1_12.32(DVDD) U1_12.33(DVDD) U1_12.34(DVDD) U1_12.39(DVDD) U1_12.40(DVDD) U1_12.41(DVDD) U1_12.42(DVDD) U1_12.45(DVDD) U1_12.46(DVDD) U1_12.47(DVDD) U1_12.48(DVDD) U1_13.3(DVDD) U1_13.4(DVDD) U1_13.6(VDDA_PLL) U1_13.7(VDD_PLL) U1_13.10(DVDD) U1_13.11(DVDD) U1_13.13(DVDD) U1_13.14(DVDD) U1_13.15(DVDD) U1_13.18(DVDD) U1_13.19(DVDD) U1_13.20(DVDD) U1_13.21(DVDD) U1_13.22(DVDD) U1_13.25(DVDD) U1_13.26(DVDD) U1_13.28(DVDD) U1_13.29(DVDD) U1_13.30(DVDD) U1_13.31(DVDD) U1_13.32(DVDD) U1_13.33(DVDD) U1_13.34(DVDD) U1_13.39(DVDD) U1_13.40(DVDD) U1_13.41(DVDD) U1_13.42(DVDD) U1_13.45(DVDD) U1_13.46(DVDD) U1_13.47(DVDD) U1_13.48(DVDD) U1_14.3(DVDD) U1_14.4(DVDD) U1_14.6(VDDA_PLL) U1_14.7(VDD_PLL) U1_14.10(DVDD) U1_14.11(DVDD) U1_14.13(DVDD) U1_14.14(DVDD) U1_14.15(DVDD) U1_14.18(DVDD) U1_14.19(DVDD) U1_14.20(DVDD) U1_14.21(DVDD) U1_14.22(DVDD) U1_14.25(DVDD) U1_14.26(DVDD) U1_14.28(DVDD) U1_14.29(DVDD) U1_14.30(DVDD) U1_14.31(DVDD) U1_14.32(DVDD) U1_14.33(DVDD) U1_14.34(DVDD) U1_14.39(DVDD) U1_14.40(DVDD) U1_14.41(DVDD) U1_14.42(DVDD) U1_14.45(DVDD) U1_14.46(DVDD) U1_14.47(DVDD) U1_14.48(DVDD) U1_15.3(DVDD) U1_15.4(DVDD) U1_15.6(VDDA_PLL) U1_15.7(VDD_PLL) U1_15.10(DVDD) U1_15.11(DVDD) U1_15.13(DVDD) U1_15.14(DVDD) U1_15.15(DVDD) U1_15.18(DVDD) U1_15.19(DVDD) U1_15.20(DVDD) U1_15.21(DVDD) U1_15.22(DVDD) U1_15.25(DVDD) U1_15.26(DVDD) U1_15.28(DVDD) U1_15.29(DVDD) U1_15.30(DVDD) U1_15.31(DVDD) U1_15.32(DVDD) U1_15.33(DVDD) U1_15.34(DVDD) U1_15.39(DVDD) U1_15.40(DVDD) U1_15.41(DVDD) U1_15.42(DVDD) U1_15.45(DVDD) U1_15.46(DVDD) U1_15.47(DVDD) U1_15.48(DVDD) U1_16.3(DVDD) U1_16.4(DVDD) U1_16.6(VDDA_PLL) U1_16.7(VDD_PLL) U1_16.10(DVDD) U1_16.11(DVDD) U1_16.13(DVDD) U1_16.14(DVDD) U1_16.15(DVDD) U1_16.18(DVDD) U1_16.19(DVDD) U1_16.20(DVDD) U1_16.21(DVDD) U1_16.22(DVDD) U1_16.25(DVDD) U1_16.26(DVDD) U1_16.28(DVDD) U1_16.29(DVDD) U1_16.30(DVDD) U1_16.31(DVDD) U1_16.32(DVDD) U1_16.33(DVDD) U1_16.34(DVDD) U1_16.39(DVDD) U1_16.40(DVDD) U1_16.41(DVDD) U1_16.42(DVDD) U1_16.45(DVDD) U1_16.46(DVDD) U1_16.47(DVDD) U1_16.48(DVDD)
3.3V: C5_1.2 C5_2.2 C5_3.2 C5_4.2 C5_5.2 C5_6.2 C5_7.2 C5_8.2 C5_9.2 C5_10.2 C5_11.2 C5_12.2 C5_13.2 C5_14.2 C5_15.2 C5_16.2 C8_1.1 C8_2.1 C8_3.1 C8_4.1 C8_5.1 C8_6.1 C8_7.1 C8_8.1 C8_9.1 C8_10.1 C8_11.1 C8_12.1 C8_13.1 C8_14.1 C8_15.1 C8_16.1 C34.1 C63.1 C73.1 C74.1 C75.1 C76.1 C211.1 C229.1 C233.1 C234.1 C235.1 C236.1 C237.1 C248.1 C249.1 C250.1 C252.1 C311.1 J1.2 R1.1 R1_1.1 R1_2.1 R1_3.1 R1_4.1 R1_5.1 R1_6.1 R1_7.1 R1_8.1 R1_9.1 R1_10.1 R1_11.1 R1_12.1 R1_13.1 R1_14.1 R1_15.1 R1_16.1 R9.2 R48.1 R49.1 R50.1 R51.1 R52.2 R53.2 R54.2 R55.2 U1.10(VDD) U1.19(AVDD) U1.26(VDD) U1.35(VUSB3V3) U1.38(VDD) U1.57(VDD) U1_1.24(OVDD1) U1_1.37(OVDD0) U1_2.24(OVDD1) U1_2.37(OVDD0) U1_3.24(OVDD1) U1_3.37(OVDD0) U1_4.24(OVDD1) U1_4.37(OVDD0) U1_5.24(OVDD1) U1_5.37(OVDD0) U1_6.24(OVDD1) U1_6.37(OVDD0) U1_7.24(OVDD1) U1_7.37(OVDD0) U1_8.24(OVDD1) U1_8.37(OVDD0) U1_9.24(OVDD1) U1_9.37(OVDD0) U1_10.24(OVDD1) U1_10.37(OVDD0) U1_11.24(OVDD1) U1_11.37(OVDD0) U1_12.24(OVDD1) U1_12.37(OVDD0) U1_13.24(OVDD1) U1_13.37(OVDD0) U1_14.24(OVDD1) U1_14.37(OVDD0) U1_15.24(OVDD1) U1_15.37(OVDD0) U1_16.24(OVDD1) U1_16.37(OVDD0) U2.5(VCC) U3.14(VCC) U6.5(Vout) U19.1(OUTPUT) U25.6(Vlogic) U30.6(Vlogic)
5.0V: C188.2 C231.1 C308.2 D1.1(A1) D1.2(A2) D2.1(A1) D2.2(A2) R42.1 R63.1 U20.3(Vin) U22.1(OUTPUT) U23.3(Vin) U25.7(VCC) U30.7(VCC)
5.0V PS: J2.4 R42.2
12V: C190.1 C191.1 C192.1 C193.1 C194.1 C195.1 C196.1 C197.1 C207.1 C213.1 C214.1 C215.1 C216.1 C217.1 C218.1 C219.1 C230.1 C263.1 C264.1 C265.1 C266.1 C267.1 C268.1 C269.1 C270.1 C273.1 C274.1 C275.1 C276.1 C277.1 C278.1 C279.1 C280.1 J2.1 J6.2 Q1.5(D) Q1.6(D) Q1.7(D) Q1.8(D) Q4.5(D) Q4.6(D) Q4.7(D) Q4.8(D) R57.1 U20.1(Vout) U22.8(INPUT) U23.1(Vout)
BOOT3: C312.1 D2.3(CC) U30.8(BOOT)
BOOT4: C189.1 D1.3(CC) U25.8(BOOT)
C1Rx: U1.58(VCMPST1/RP96/RF0)
C1Tx: U1.59(VCMPST2/RP97/RF1)
C_CLK_OUT1: U1_1.43(CORE_CLKOUT)
C_CLK_OUT2: U1_2.43(CORE_CLKOUT)
C_CLK_OUT3: U1_3.43(CORE_CLKOUT)
C_CLK_OUT4: U1_4.43(CORE_CLKOUT)
C_CLK_OUT5: U1_5.43(CORE_CLKOUT)
C_CLK_OUT6: U1_6.43(CORE_CLKOUT)
C_CLK_OUT7: U1_7.43(CORE_CLKOUT)
C_CLK_OUT8: U1_8.43(CORE_CLKOUT)
C_CLK_OUT9: U1_9.43(CORE_CLKOUT)
C_CLK_OUT10: U1_10.43(CORE_CLKOUT)
C_CLK_OUT11: U1_11.43(CORE_CLKOUT)
C_CLK_OUT12: U1_12.43(CORE_CLKOUT)
C_CLK_OUT13: U1_13.43(CORE_CLKOUT)
C_CLK_OUT14: U1_14.43(CORE_CLKOUT)
C_CLK_OUT15: U1_15.43(CORE_CLKOUT)
C_CLK_OUT16: U1_16.43(CORE_CLKOUT)
CAN5.0V: R47.1 R64.1
CONFIG_N1: U1.42(RTCC/DMLN/RPI72/RD8) U1_1.2(CONFIG_NI)
CONFIG_N2: U1_1.35(CONFIG_NO) U1_2.2(CONFIG_NI)
CONFIG_N3: U1_2.35(CONFIG_NO) U1_3.2(CONFIG_NI)
CONFIG_N4: U1_3.35(CONFIG_NO) U1_4.2(CONFIG_NI)
CONFIG_N5: U1_4.35(CONFIG_NO) U1_5.2(CONFIG_NI)
CONFIG_N6: U1_5.35(CONFIG_NO) U1_6.2(CONFIG_NI)
CONFIG_N7: U1_6.35(CONFIG_NO) U1_7.2(CONFIG_NI)
CONFIG_N8: U1_7.35(CONFIG_NO) U1_8.2(CONFIG_NI)
CONFIG_N9: R25.2 U1_8.35(CONFIG_NO)
CONFIG_N9I: R25.1 U1.54(C3IN2-/RP70/RD6) U1_9.2(CONFIG_NI)
CONFIG_N10: U1_9.35(CONFIG_NO) U1_10.2(CONFIG_NI)
CONFIG_N11: U1_10.35(CONFIG_NO) U1_11.2(CONFIG_NI)
CONFIG_N12: U1_11.35(CONFIG_NO) U1_12.2(CONFIG_NI)
CONFIG_N13: U1_12.35(CONFIG_NO) U1_13.2(CONFIG_NI)
CONFIG_N14: U1_13.35(CONFIG_NO) U1_14.2(CONFIG_NI)
CONFIG_N15: U1_14.35(CONFIG_NO) U1_15.2(CONFIG_NI)
CONFIG_N16: U1_15.35(CONFIG_NO) U1_16.2(CONFIG_NI)
CONFIG_N17: U1_16.35(CONFIG_NO)
CONFIG_P1: U1.43(ASDA1/DPLN/RPI73/RD9) U1_1.1(CONFIG_PI)
CONFIG_P2: U1_1.36(CONFIG_PO) U1_2.1(CONFIG_PI)
CONFIG_P3: U1_2.36(CONFIG_PO) U1_3.1(CONFIG_PI)
CONFIG_P4: U1_3.36(CONFIG_PO) U1_4.1(CONFIG_PI)
CONFIG_P5: U1_4.36(CONFIG_PO) U1_5.1(CONFIG_PI)
CONFIG_P6: U1_5.36(CONFIG_PO) U1_6.1(CONFIG_PI)
CONFIG_P7: U1_6.36(CONFIG_PO) U1_7.1(CONFIG_PI)
CONFIG_P8: U1_7.36(CONFIG_PO) U1_8.1(CONFIG_PI)
CONFIG_P9: R24.2 U1_8.36(CONFIG_PO)
CONFIG_P9I: R24.1 U1.55(C3IN1+/VCMPST3/RP71/RD7) U1_9.1(CONFIG_PI)
CONFIG_P10: U1_9.36(CONFIG_PO) U1_10.1(CONFIG_PI)
CONFIG_P11: U1_10.36(CONFIG_PO) U1_11.1(CONFIG_PI)
CONFIG_P12: U1_11.36(CONFIG_PO) U1_12.1(CONFIG_PI)
CONFIG_P13: U1_12.36(CONFIG_PO) U1_13.1(CONFIG_PI)
CONFIG_P14: U1_13.36(CONFIG_PO) U1_14.1(CONFIG_PI)
CONFIG_P15: U1_14.36(CONFIG_PO) U1_15.1(CONFIG_PI)
CONFIG_P16: U1_15.36(CONFIG_PO) U1_16.1(CONFIG_PI)
CONFIG_P17: U1_16.36(CONFIG_PO)
CSN4: R38.1 U1.14(AN2/C2IN2-/VMIO/RPI34/RB2)
CSP4: R37.1 U1.13(AN3/C2IN1+/VPIO/RPI35/RB3)
D+: C254.2 R35.2 U1.37(D+/RG2)
D-: C253.2 R34.2 U1.36(D-/RG3)
FAN5.0V: R63.2 R64.2
FB: C251.1 R43.1 U1.17(PGEC1/AN6/RPI38/RB6)
GREEN: D5.2(A) U1.62(AN26/PWM2L/PMD2/RP82/RE2)
HO3: Q4.4(G) U30.1(HO)
HO4: Q1.4(G) U25.1(HO)
LDO5.0V: C187.1 R46.1 R47.2 R62.2 U6.1(Vin) U6.3(STBY) U19.5(N.C.) U19.8(INPUT)
LMGND: D3.3(CC) R60.2 U20.2(GND) U22.2(GND) U22.3(GND) U22.4(N.C.) U22.5(N.C.) U22.6(GND) U22.7(GND) U23.2(GND)
LO3: Q5.4(G) Q6.4(G) U30.3(LO)
LO4: Q2.4(G) Q3.4(G) U25.3(LO)
Main OSC In: C85.1 U1.39(OSC1/RPI60/RC12) Y1.1
Main OSC Out: C86.1 U1.40(OSC2/CLKO/RC15) Y1.2
MCLR: C72.1 J1.1 R9.1 U1.7(MCLR)
MEAS12: C325.1 R57.2 R61.2 U1.18(PGED1/AN7/RCV/RPI39/RB7)
ORANGE: D7.2(A) U1.45(PMCS1/RPI75/RD11)
PGC: J1.5 U1.15(PGEC3/AN1/VREF-/RPI33/RB1)
PGD: J1.4 U1.16(PGED3/AN0/VREF+/RPI32/RB0)
PWM: J6.4 U1.61(AN25/PWM1H/PMD1/RPI81/RE1)
PWM3H: R59.2 U1.1(AN29/PWM3H/PMD5/RP85/RE5) U30.5(IN)
PWM3L: U1.64(AN28/PWM3L/PMD4/RP84/RE4)
PWM4H: R40.2 U1.3(AN31/PWM4H/PMD7/RP87/RE7) U25.5(IN)
PWM4L: U1.2(AN30/PWM4L/PMD6/RPI86/RE6)
RED: D4.2(A) U1.63(AN27/PWM2H/PMD3/RPI83/RE3)
REPORT_N1-4: R18.2 R22.2 R50.2 U1.48(PGEC2/SOSCO/C3IN1-/T1CK/RPI62/RC14) U1_1.16(REPORT_N) U1_2.16(REPORT_N) U1_3.16(REPORT_N) U1_4.16(REPORT_N)
REPORT_N5-8: R18.1 R49.2 U1.50(DPH/RP66/RD2) U1_5.16(REPORT_N) U1_6.16(REPORT_N) U1_7.16(REPORT_N) U1_8.16(REPORT_N)
REPORT_N9-12: R26.2 R55.1 U1.30(AN15/PMA0/RPI47/RB15) U1_9.16(REPORT_N) U1_10.16(REPORT_N) U1_11.16(REPORT_N) U1_12.16(REPORT_N)
REPORT_N13-16: R22.1 R26.1 R54.1 U1.29(AN14/PMA1/RPI46/RB14) U1_13.16(REPORT_N) U1_14.16(REPORT_N) U1_15.16(REPORT_N) U1_16.16(REPORT_N)
REPORT_P1-4: R19.2 R23.2 R51.2 U1.47(PGED2/SOSCI/C3IN3-/RPI61/RC13) U1_1.17(REPORT_P) U1_2.17(REPORT_P) U1_3.17(REPORT_P) U1_4.17(REPORT_P)
REPORT_P5-8: R19.1 R48.2 U1.51(PMBE/RP67/RD3) U1_5.17(REPORT_P) U1_6.17(REPORT_P) U1_7.17(REPORT_P) U1_8.17(REPORT_P)
REPORT_P9-12: R27.2 R53.1 U1.28(TDI/AN13/PMA10/RPI45/RB13) U1_9.17(REPORT_P) U1_10.17(REPORT_P) U1_11.17(REPORT_P) U1_12.17(REPORT_P)
REPORT_P13-16: R23.1 R27.1 R52.1 U1.27(TCK/AN12/PMA11/RPI44/RB12) U1_13.17(REPORT_P) U1_14.17(REPORT_P) U1_15.17(REPORT_P) U1_16.17(REPORT_P)
RESET1: C10_1.1 R1_1.2 U1_1.44(RSTN)
RESET2: C10_2.1 R1_2.2 U1_2.44(RSTN)
RESET3: C10_3.1 R1_3.2 U1_3.44(RSTN)
RESET4: C10_4.1 R1_4.2 U1_4.44(RSTN)
RESET5: C10_5.1 R1_5.2 U1_5.44(RSTN)
RESET6: C10_6.1 R1_6.2 U1_6.44(RSTN)
RESET7: C10_7.1 R1_7.2 U1_7.44(RSTN)
RESET8: C10_8.1 R1_8.2 U1_8.44(RSTN)
RESET9: C10_9.1 R1_9.2 U1_9.44(RSTN)
RESET10: C10_10.1 R1_10.2 U1_10.44(RSTN)
RESET11: C10_11.1 R1_11.2 U1_11.44(RSTN)
RESET12: C10_12.1 R1_12.2 U1_12.44(RSTN)
RESET13: C10_13.1 R1_13.2 U1_13.44(RSTN)
RESET14: C10_14.1 R1_14.2 U1_14.44(RSTN)
RESET15: C10_15.1 R1_15.2 U1_15.44(RSTN)
RESET16: C10_16.1 R1_16.2 U1_16.44(RSTN)
RPM: R44.1 R45.2 U1.60(AN24/PWM1L/PMD0/RP80/RE0)
RPMF: J6.3 R44.2
SWN3: C312.2 L2.1 Q4.1(S) Q4.2(S) Q4.3(S) Q5.5(D) Q5.6(D) Q5.7(D) Q5.8(D) Q6.5(D) Q6.6(D) Q6.7(D) Q6.8(D) U30.2(SW)
SWN4: C189.2 L1.1 Q1.1(S) Q1.2(S) Q1.3(S) Q2.5(D) Q2.6(D) Q2.7(D) Q2.8(D) Q3.5(D) Q3.6(D) Q3.7(D) Q3.8(D) R36.2 U25.2(SW)
U2Rx: U1.31(SDA2/PMA9/RP100/RF4)
U2Tx: U1.32(SCL2/PMA8/RP101/RF5)
USB5.0V: J3.1 R46.2 R56.2
USBDM/D-: J3.2 R34.1
USBDP/D+: J3.3 R35.1
USBMCU5.0V: R56.1 R62.1 U1.34(VBUS)
VCAP: C17.1 U1.56(VCAP)
XCLK1: Q7.1(B) R2.2 U1.46(INT0/DMH/RP64/RD0) U1.49(VCPCON/RP65/RD1) U1.52(PMWR/RP68/RD4) U1.53(PMRD/RP69/RD5) U2.1(1B) U3.2(1A)
XCLKIN: Q7.3(C) R1.2 R2.1 U1_1.9(XCLKIN) U1_2.9(XCLKIN) U1_3.9(XCLKIN) U1_4.9(XCLKIN) U1_5.9(XCLKIN) U1_6.9(XCLKIN) U1_7.9(XCLKIN) U1_8.9(XCLKIN) U1_9.9(XCLKIN) U1_10.9(XCLKIN) U1_11.9(XCLKIN) U1_12.9(XCLKIN) U1_13.9(XCLKIN) U1_14.9(XCLKIN) U1_15.9(XCLKIN) U1_16.9(XCLKIN) U2.4(1Y) U3.1(1Y)
YELLOW: D6.2(A) U1.44(ASCL1/PMCS2/RPI74/RD10)
NetC209_1: C209.1 R36.1 R37.2

Not connected (* = marked no-connect by the designer): J3 4; U1 4(C1IN3-/SCK2/PMA5/RP118/RG6) 5(C1IN1-/SDI2/PMA4/RPI119/RG7) 6(C2IN3-/SDO2/PMA3/RP120/RG8) 8(C2IN1-/PMA2/RPI121/RG9) 11(AN5/C1IN1+/VBUSON/VBUSST/RPI37/RB5) 12(AN4/C1IN2-/USBOEN/RPI36/RB4) 21(AN8/PMA6/RPI40/RB8) 22(AN9/PMA7//RPI41/RB9) 23(TMS/AN10/CVREF/PMA13/RPI42/RB10) 24(TDO/AN11/PMA12/RPI43/RB11) 33(USBID/RP99/RF3); U3 4(2Y) 5(2A) 6(2B) 8(3A) 9(3B) 10(3Y) 11(4A) 12(4B) 13(4Y); U6 4(NC); U19 2(GND) 3(GND) 4(N.C.)

## Notes on the sheet
- Swapped XCLK1 and XCLK9I
- MCU Pins
- (in symbol C_POL) +
- (in symbol CON_USB_MINI_1) gnd

## Library data of the parts
C1_1-C1_16 C2_1-C2_16 C3_1-C3_16 C4_1-C4_16 C5_1-C5_16 C6_1-C6_16 C7_1-C7_16 C8_1-C8_16 C9_1-C9_16 C10_1-C10_16 C11_1-C11_16 = Cap Semi: Capacitor (Semiconductor SIM Model); Published: 8-Jun-2000; LatestRevisionDate: 29-May-2009; LatestRevisionNote: IPC-7351 Footprint Added.; PackageReference: C1206; Publisher: Altium Limited; PackageDescription: Chip Capacitor; Value: 470nF; Manufacturer PN: *
C17 C34 C63 C72-C76 C85 C86 C187-C205 C207 C209 C211 C213-C227 C229-C231 C233-C237 C240-C254 C258-C270 C273-C280 C283-C306 C308 C311 C312 C314-C325 = CAP: Capacitor; Manufacturer PN: *
C212 C228 C232 C238 C239 C256 C257 C271 C282 C307 C309 C313 = C_POL: NOTE: <NOTE>; Manufacturer PN: *
D1-D3 = D_DUAL_A1A2CC3: NOTE: <NOTE>; Manufacturer PN: *
D4-D7 = LED_2: NOTE: <NOTE>; Manufacturer PN: *
J1 = CON5: Connector; Manufacturer PN: *
J2 J6 = CON_4PINS: Manufacturer PN: *
J3 = CON_USB_MINI_1: NOTE: <NOTE>; Manufacturer PN: *
L1 L2 = L: Manufacturer PN: *
Q1-Q6 = MOS_N_D1_S1S2S3G4D5D6D7D8: NOTE: <NOTE>; Manufacturer PN: *
Q7 = BJT_NPN_B1E2C3: NOTE: <NOTE>; Manufacturer PN: *
R1 R1_1-R1_16 R2 R9 R18 R19 R22-R27 R34-R38 R40 R42-R57 R59-R64 = Res3: Resistor; Published: 8-Jun-2000; LatestRevisionDate: 29-May-2009; LatestRevisionNote: IPC-7351 Footprint Added.; PackageReference: J1-0603; Publisher: Altium Limited; PackageDescription: Chip Resistor; Manufacturer PN: *
  R1 R48 R49 R52-R55: Value: (OPT)470
  R1_1-R1_16: Value: 100K
  R2 R18 R19 R22-R27 R46 R47 R56 R60 R63 R64: Value: 0
  R9 R40 R43 R44 R57 R59: Value: 10k
  R34 R35: Value: 27
  R36: Value: 768
  R37 R38 R45 R61: Value: 2.4k
  R42 R62: Value: (OPT)0
  R50 R51: Value: 470
U1_1-U1_16 = A3255Q48: Avalon2 SHA256; Manufacturer PN: *
U2 = 74AUP1G02GW: Manufacturer PN: *
U3 = 74HC02: Manufacturer PN: *
U6 = VOLTREG LDO: Manufacturer PN: *
U19 U22 = IC_LM2931AD-5.0R2G_SO-8: Manufacturer PN: *
U20 U23 = IC_Vout1GND2Vin3: NOTE: <NOTE>; Manufacturer PN: *
U25 U30 = DRVFET_LTC4442: Mosfet 12V Dual Bootstrapped PWM Sync Buck Optimised; Manufacturer PN: *
Y1 = CRYSTAL: Manufacturer PN: *
U1 = dsPIC33EP256MU806: Manufacturer PN: *